# Altium project COMM_BOARD_V1.PrjPcb (part 1 of 2)
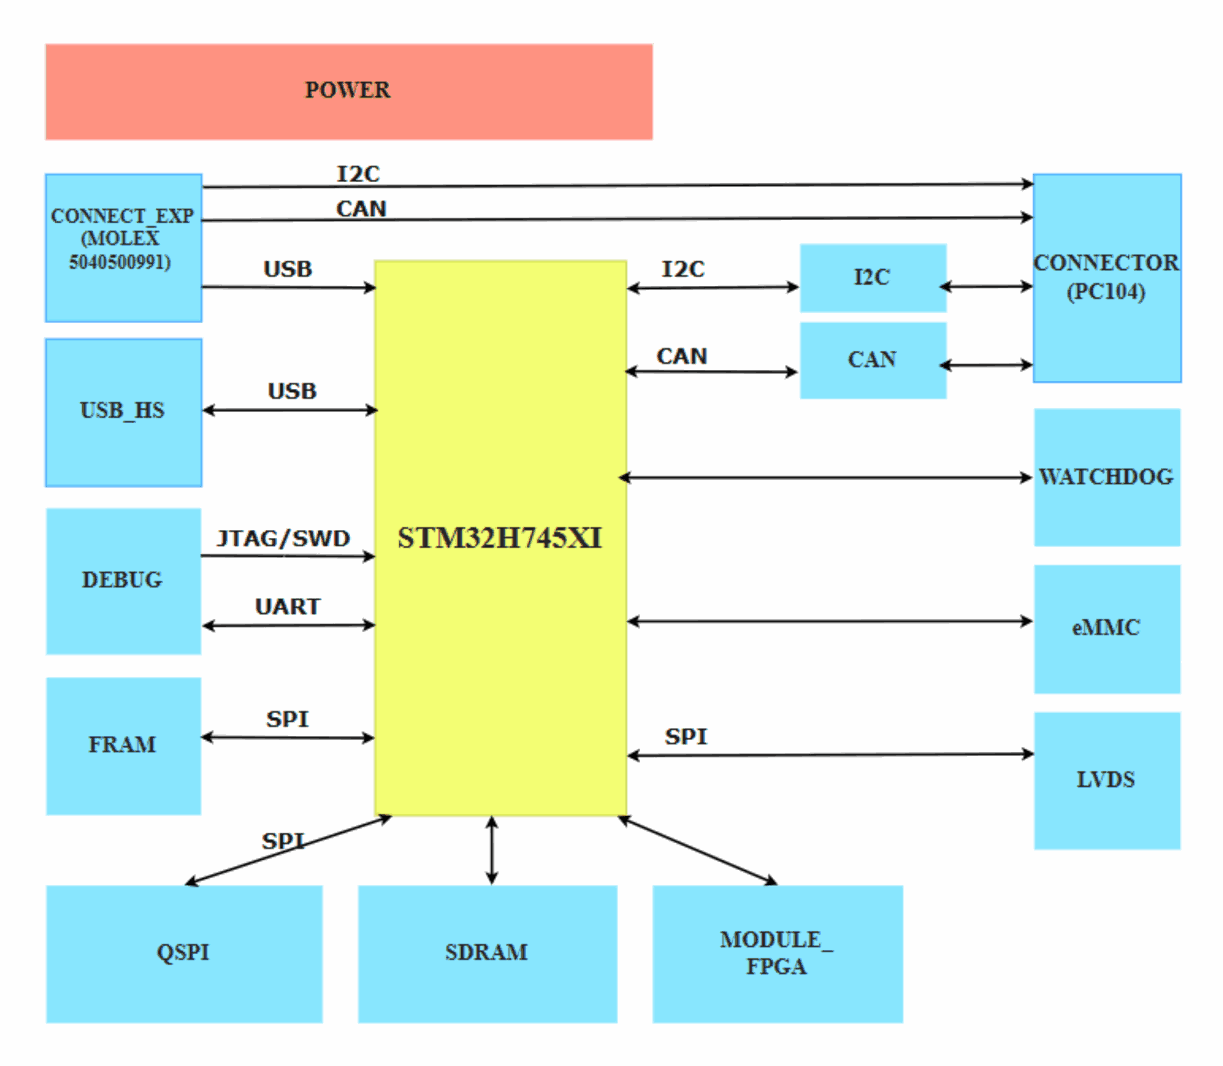
[diagram p0: BLOCK_DIAGRAM.SchDoc]
Board_Assembly_Revision: 04; Board_Document_Date: 27-Sep-2024; Board_Name: STM32H7xxx-Disco; Board_PCB_Revision: B; Board_Reference: MB1381
17 sheets, 294 parts. Net scope: flat (ports and power ports of the same name join across sheets).
Board file: PAY-IF_R100.PcbDoc
Sheets:
  BLOCK_DIAGRAM.SchDoc
  POWER_TREE.SchDoc
  CONNECTOR.SchDoc
  POWER.SchDoc
  USB_FS.SchDoc
  eMMC.SchDoc
  SDRAM.SchDoc
  MRAM.SchDoc
  LVDS.SchDoc
  CAN.SchDoc
  I2C.SchDoc
  FRAM.SchDoc
  TEMP_CTRL.SchDoc
  WATCHDOG.SchDoc
  DEBUG.SchDoc
  MCU_POWER.SchDoc
  MCU.SchDoc

## Sheet BLOCK_DIAGRAM.SchDoc
size 420 x 297 mm; DocumentNumber: 1; SheetNumber: 1; SheetTotal: 16

### Notes on the sheet
- Project:
- BEE-PC1
- Sub-system:
- NANORACK_EXP_CONTROLLER
- Design by:
- SANG HUYNH
- BAO BUI Q.
- Sheet title:
- Sheet
- A3
- of
- Checked by:
- Approved by:
- VU PHAM
- Revision:
- Document No:
- V1.2.2
- Size:
- Date:

## Sheet POWER_TREE.SchDoc
size 420 x 297 mm; DocumentNumber: 2; SheetNumber: 2; SheetTotal: 16

### Notes on the sheet
- Project:
- BEE-PC1
- Sub-system:
- NANORACK_EXP_CONTROLLER
- Design by:
- SANG HUYNH
- BAO BUI Q.
- Sheet title:
- Sheet
- A3
- of
- Checked by:
- Approved by:
- VU PHAM
- Revision:
- Document No:
- V1.2.2
- Size:
- Date:
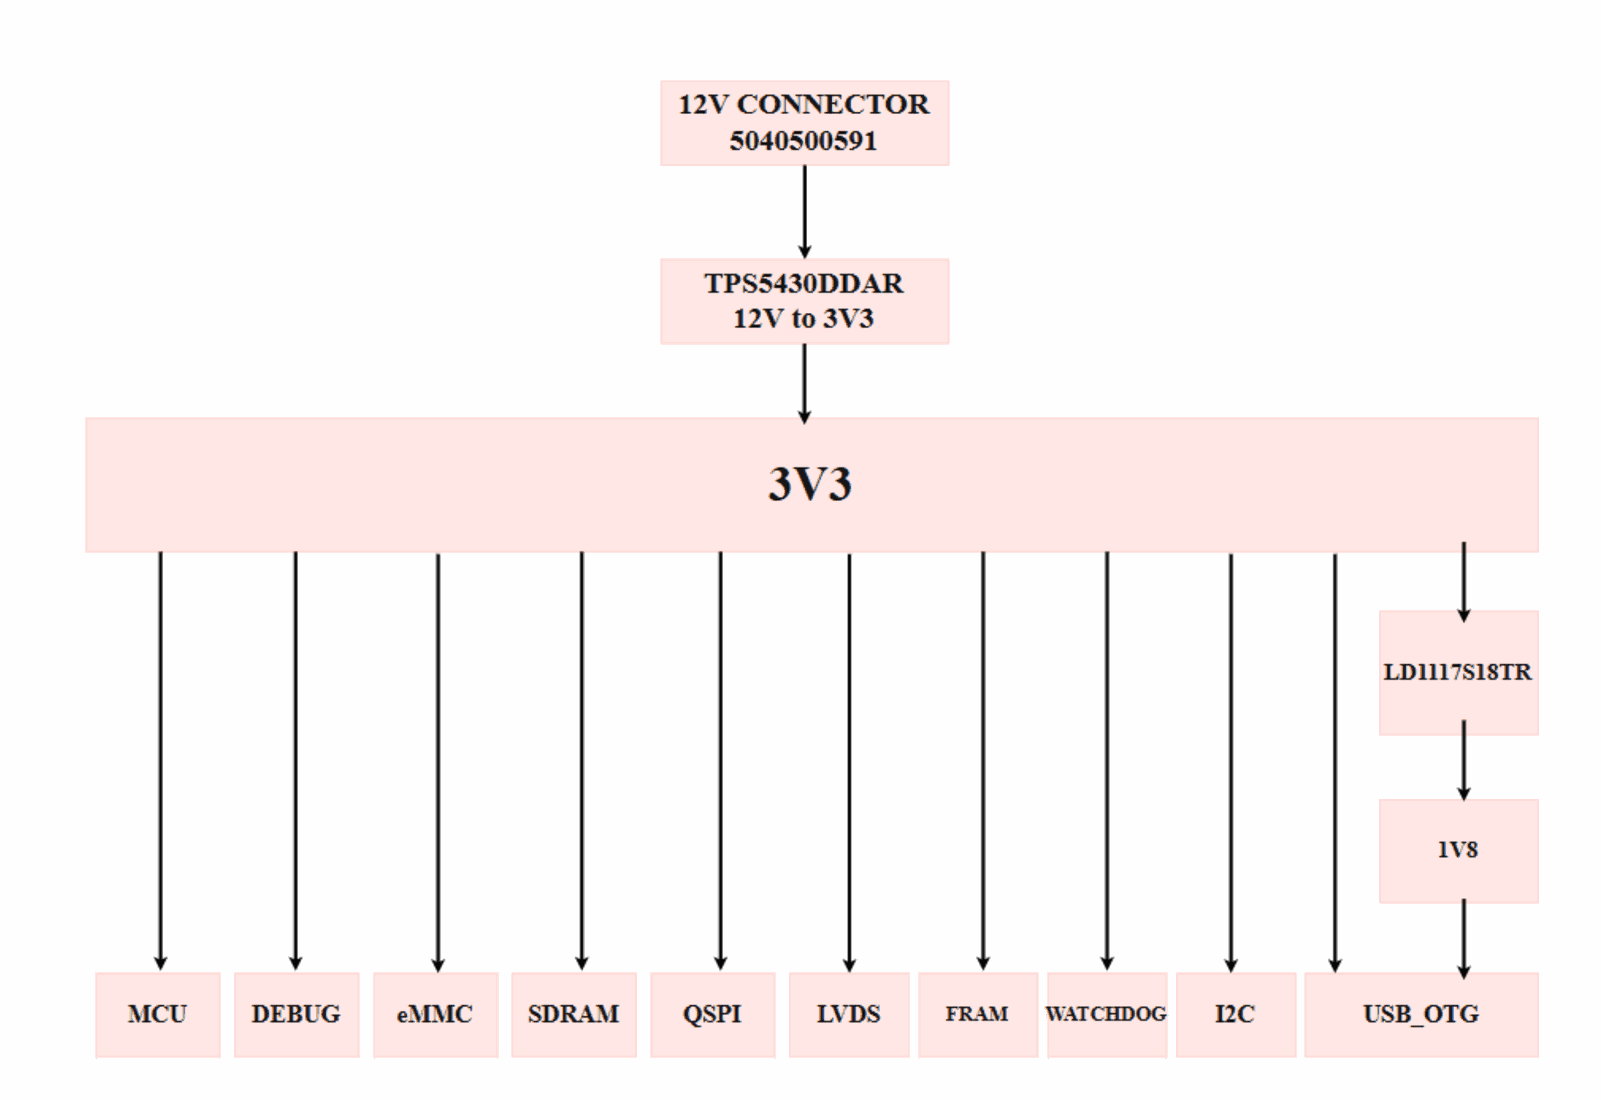
[diagram p1: POWER_TREE.SchDoc]

## Sheet CONNECTOR.SchDoc
size 420 x 297 mm; DocumentNumber: 3; SheetNumber: 3; SheetTotal: 17
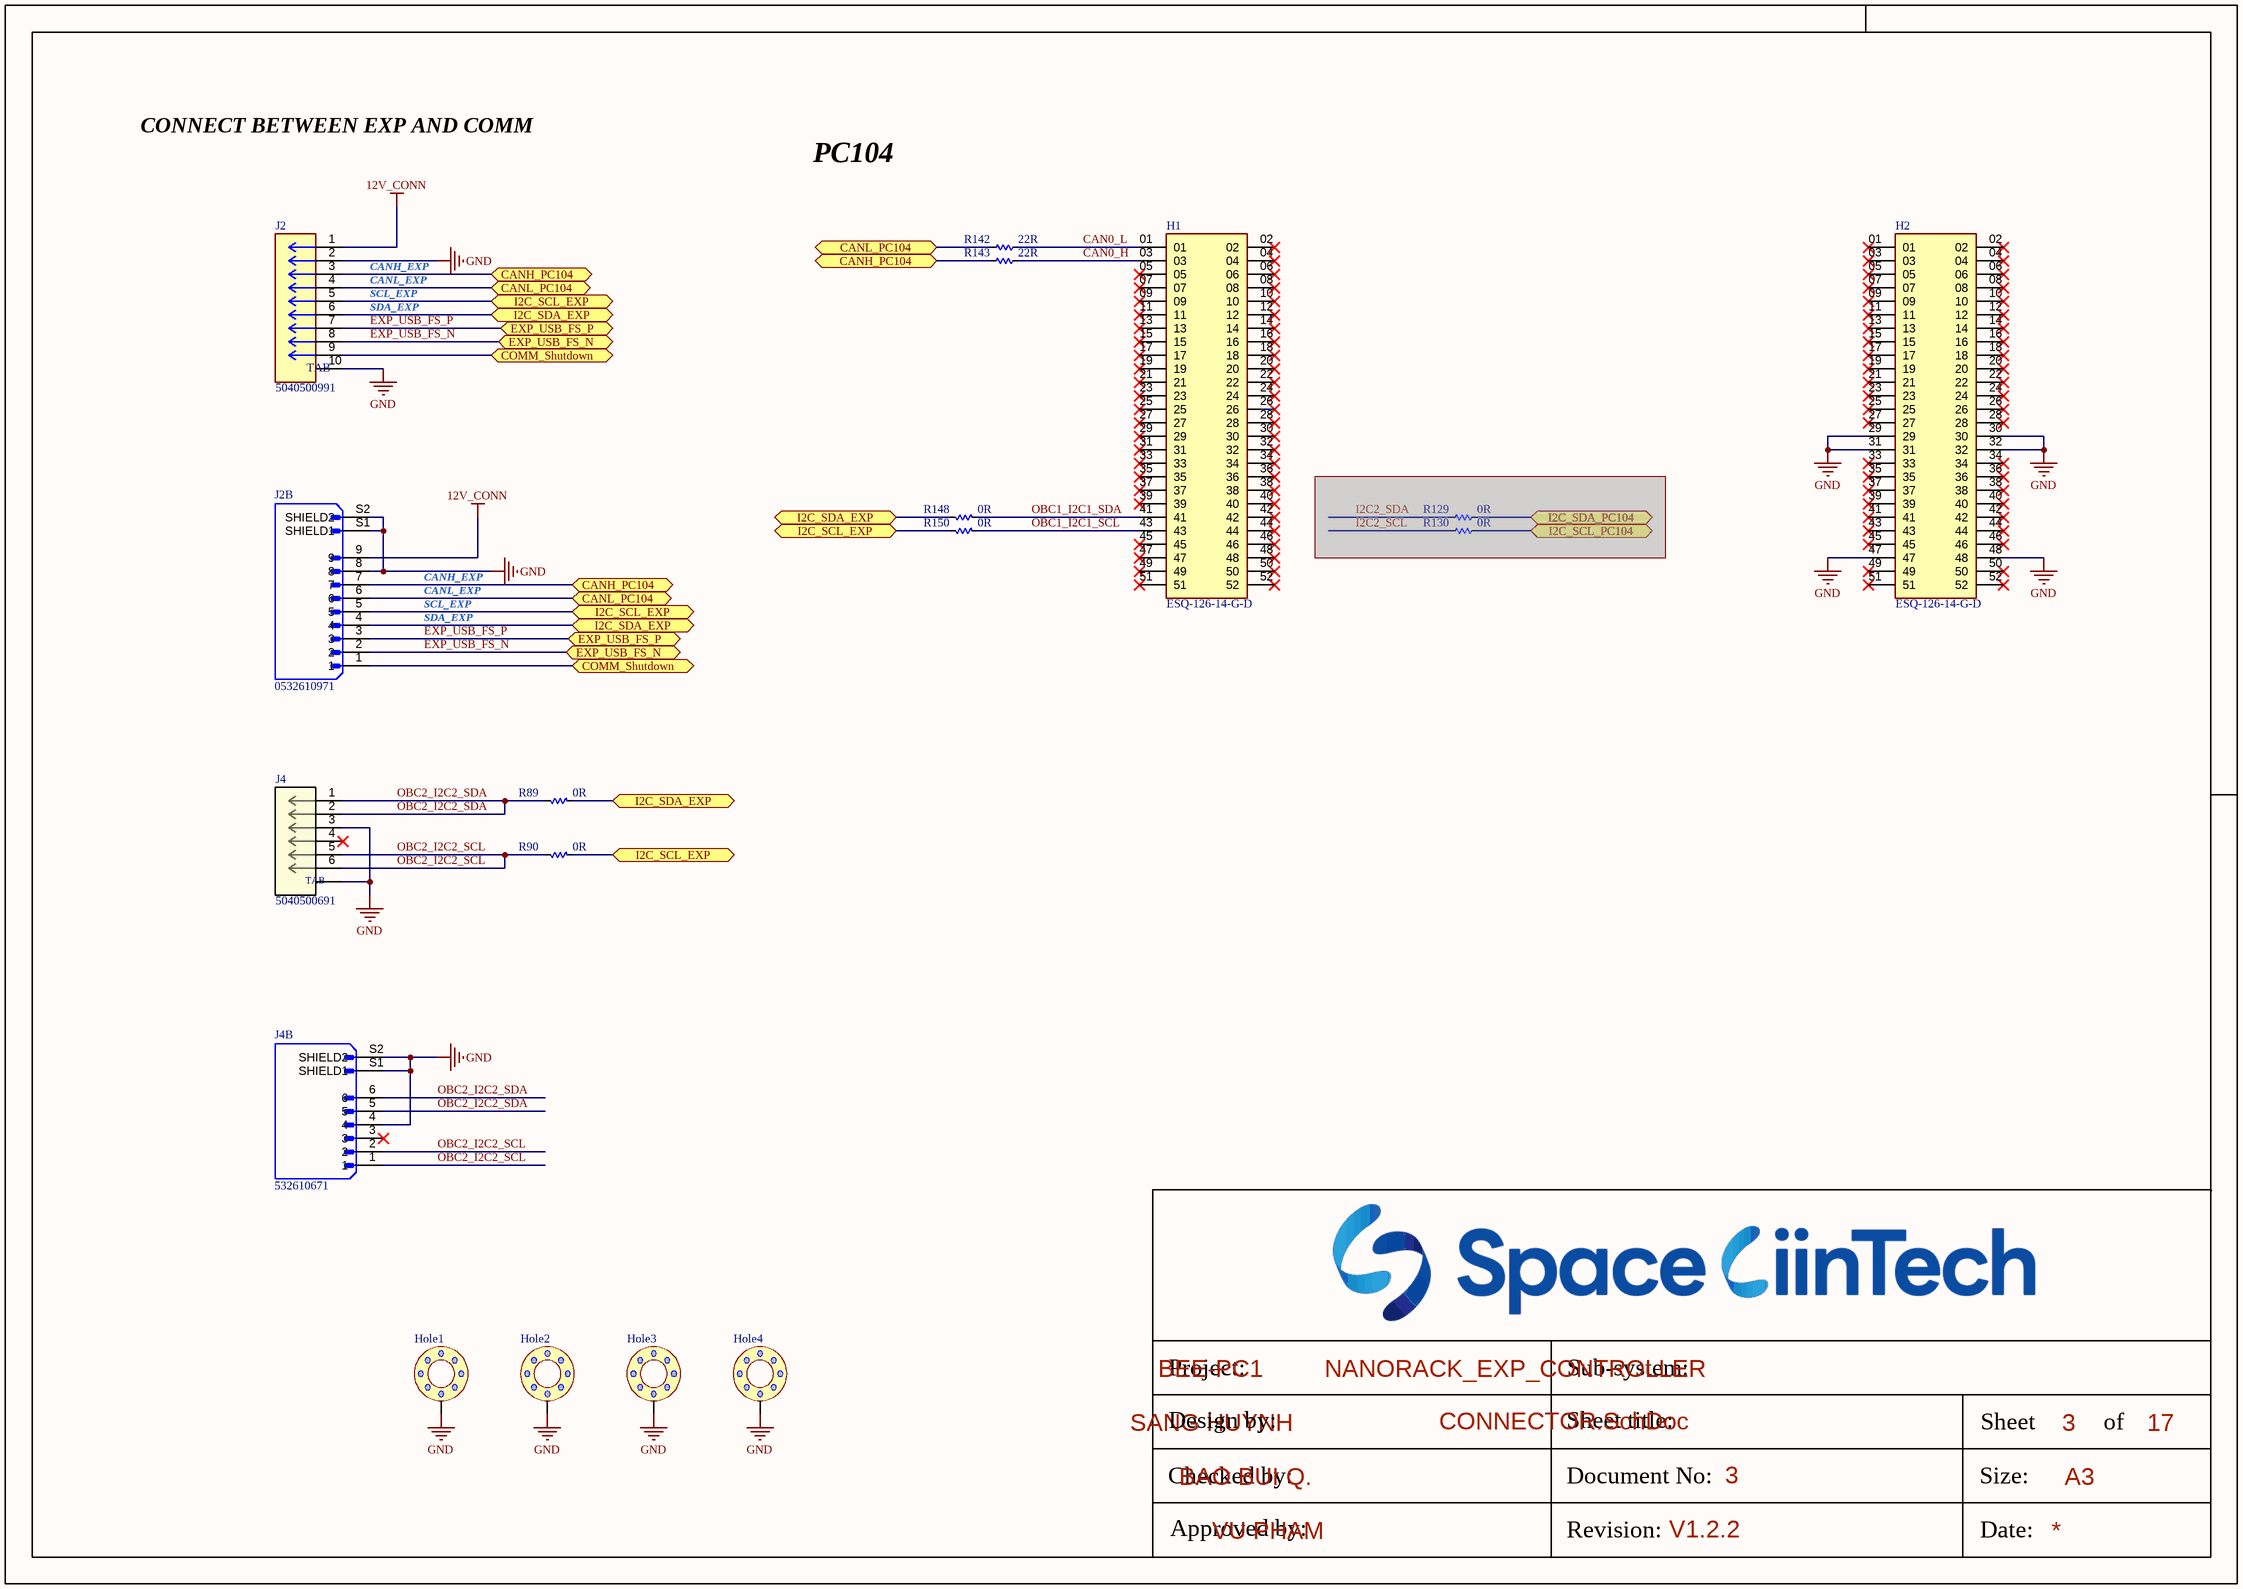
[diagram p2: CONNECTOR.SchDoc]

### Parts
H1  ESQ-126-14-G-D  [SAMTEC_ESQ-126-14-G-D]
H2  ESQ-126-14-G-D  [SAMTEC_ESQ-126-14-G-D]
Hole1  hole_space  [HOLE_SPACE]  (value not drawn)
Hole2  hole_space  [HOLE_SPACE]  (value not drawn)
Hole3  hole_space  [HOLE_SPACE]  (value not drawn)
Hole4  hole_space  [HOLE_SPACE]  (value not drawn)
J2  5040500991  [5040500991]
J2B  0532610971  [0532610971]
J4  5040500691  [5040500691]
J4B  532610671  [MOLEX_532610671]
R89  0R  [RES_C_1608X60]
R90  0R  [RES_C_1608X60]
R129  0R  [RES_C_1608X60]  (masked out: inside a compile mask, not in the netlist)
R130  0R  [RES_C_1608X60]  (masked out: inside a compile mask, not in the netlist)
R142  22R  [RES_C_1608X60]
R143  22R  [RES_C_1608X60]
R148  0R  [RES_C_1608X60]
R150  0R  [RES_C_1608X60]

### Ports
CANH_PC104 (bidir), CANL_PC104 (bidir), COMM_Shutdown (bidir), EXP_USB_FS_N (bidir), EXP_USB_FS_P (bidir), I2C_SCL_EXP (bidir), I2C_SCL_PC104 (bidir), I2C_SDA_EXP (bidir), I2C_SDA_PC104 (bidir)

### Nets
12V_CONN: J2.1 J2B.9
GND: H2.29 H2.30 H2.31 H2.32 H2.47 H2.48 Hole1.1 Hole2.1 Hole3.1 Hole4.1 J2.2 J2.10 J2B.8 J2B.S1(SHIELD1) J2B.S2(SHIELD2) J4.3 J4.7 J4B.4 J4B.S1(SHIELD1) J4B.S2(SHIELD2)
CAN0_H: H1.03 R143.2
CAN0_L: H1.01 R142.2
EXP_USB_FS_N: J2.8 J2B.2 ; port EXP_USB_FS_N
EXP_USB_FS_P: J2.7 J2B.3 ; port EXP_USB_FS_P
OBC1_I2C1_SCL: H1.43 R150.1
OBC1_I2C1_SDA: H1.41 R148.1
OBC2_I2C2_SCL: J4.5 J4.6 J4B.1 J4B.2 R90.2
OBC2_I2C2_SDA: J4.1 J4.2 J4B.5 J4B.6 R89.2
NetJ2_3: J2.3 J2B.7 R143.1 ; port CANH_PC104
NetJ2_4: J2.4 J2B.6 R142.1 ; port CANL_PC104
NetJ2_5: J2.5 J2B.5 R90.1 R150.2 ; port I2C_SCL_EXP
NetJ2_6: J2.6 J2B.4 R89.1 R148.2 ; port I2C_SDA_EXP
NetJ2_9: J2.9 J2B.1 ; port COMM_Shutdown

Not connected (* = marked no-connect by the designer): H1 02* 04* 05* 06* 07* 08* 09* 10* 11* 12* 13* 14* 15* 16* 17* 18* 19* 20* 21* 22* 23* 24* 25* 26* 27* 28* 29* 30* 31* 32* 33* 34* 35* 36* 37* 38* 39* 40* 42* 44* 45* 46* 47* 48* 49* 50* 51* 52*; H2 01* 02* 03* 04* 05* 06* 07* 08* 09* 10* 11* 12* 13* 14* 15* 16* 17* 18* 19* 20* 21* 22* 23* 24* 25* 26* 27* 28* 33* 34* 35* 36* 37* 38* 39* 40* 41* 42* 43* 44* 45* 46* 49* 50* 51* 52*; J4 4*; J4B 3*

### Notes on the sheet
- CONNECT BETWEEN EXP AND COMM
- PC104
- CANL_EXP
- CANH_EXP
- SCL_EXP
- SDA_EXP
- Project:
- BEE-PC1
- Sub-system:
- NANORACK_EXP_CONTROLLER
- Design by:
- SANG HUYNH
- BAO BUI Q.
- Sheet title:
- Sheet
- A3
- of
- Checked by:
- Approved by:
- VU PHAM
- Revision:
- Document No:
- V1.2.2
- Size:
- Date:
- (in symbol 5040500691) TAB
- (in symbol 5040500991) TAB

### Library data of the parts
H1 H2 = ESQ-126-14-G-D: MF: Samtec; MP: ESQ-126-14-G-D; Price: None; Package: None; Value: *; Availability: Unavailable
J2 = 5040500991: Connector Header Surface Mount, Right Angle 9 position 0.059" (1.50mm)
J2B = CONN_SMD_09: CONN HEADER SMD R/A 9POS 1.25MM
J4 = 5040500691: 1.50mm Pitch, Pico-Lock PCB Header, Single Row, Right-Angle, Surface Mount, Gold (Au) Plating, Positive Lock, 6 Circuits, Tape and Reel; Manufacturer_Name: Molex Connector Corporation; Copyright: Copyright (C) 2025 Ultra Librarian. All rights reserved.; Manufacturer_Part_Number: 5040500691; Datasheet: https://www.molex.com/en-us/products/part-detail-pdf/5040500691?display=pdf; RefDes: RefDes; Type: Type
J4B = CONN_SMD_06: Value: *; Availability: Unavailable; Package: None; MP: 532610671; Price: None
R89 R90 R129 R130 R142 R143 R148 R150 = _RES_B_2: RES

## Sheet POWER.SchDoc
size 420 x 297 mm; DocumentNumber: 4; SheetNumber: 4; SheetTotal: 17
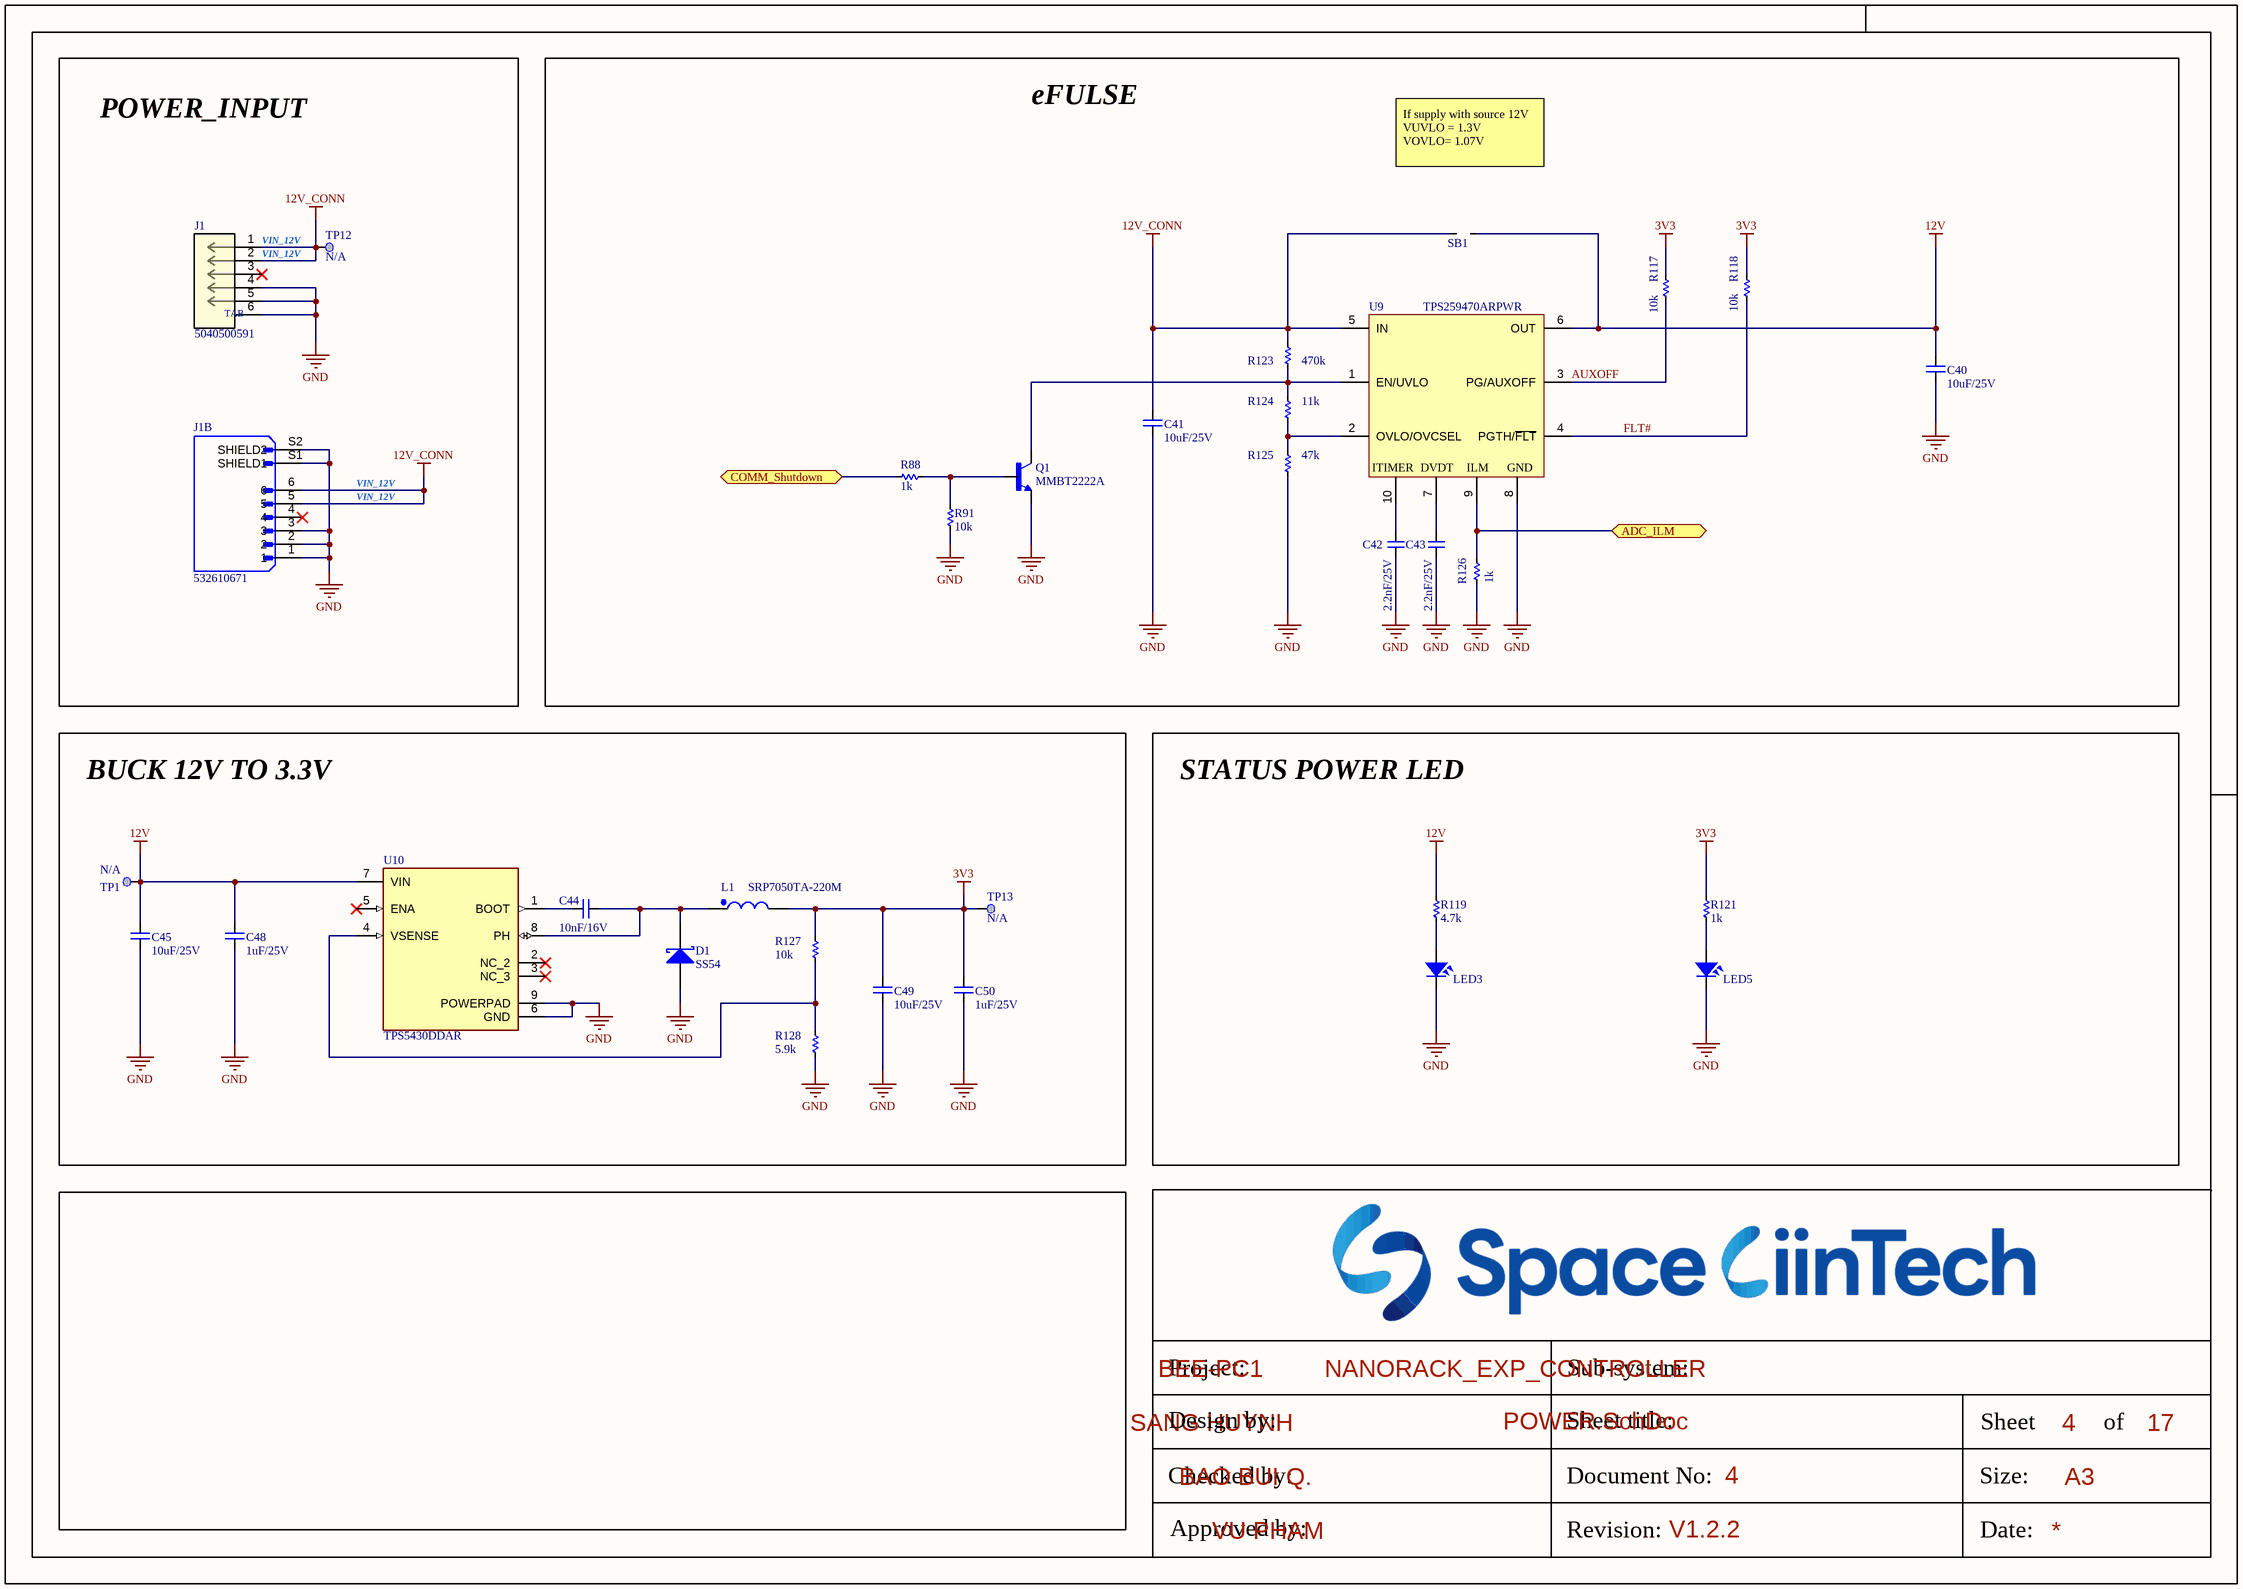
[diagram p3: POWER.SchDoc]

### Parts
C40  10uF/25V  [CAP_C_1608X80]
C41  10uF/25V  [CAP_C_1608X80]
C42  2.2nF/25V  [CAP_C_1608X80]
C43  2.2nF/25V  [CAP_C_1608X80]
C44  10nF/16V  [CAP_C_1608X80]
C45  10uF/25V  [CAP_C_1608X80]
C48  1uF/25V  [CAP_C_1608X80]
C49  10uF/25V  [CAP_C_1608X80]
C50  1uF/25V  [CAP_C_1608X80]
D1  SS54  [DO-214AC_SMA]
J1  5040500591  [5040500591]
J1B  532610671  [MOLEX_532610671]
L1  SRP7050TA-220M  [SRP7050TA-220M]
LED3  150060RS75000  [LED_0603]  (value not drawn)
LED5  150060YS75000  [LED_0603]  (value not drawn)
Q1  MMBT2222A  [SOT95P240X120-3N]
R88  1k  [RES_C_1608X60]
R91  10k  [RES_C_1608X60]
R117  10k  [RES_C_1608X60]
R118  10k  [RES_C_1608X60]
R119  4.7k  [RES_C_1608X60]
R121  1k  [RES_C_1608X60]
R123  470k  [RES_C_1608X60]
R124  11k  [RES_C_1608X60]
R125  47k  [RES_C_1608X60]
R126  1k  [RES_C_1608X60]
R127  10k  [RES_C_1608X60]
R128  5.9k  [RES_C_1608X60]
SB1  JUMPER  [JUMPER_1608]  (value not drawn)
TP1  Test Point  [TESTPOINT]  (value not drawn)  (no BOM)
TP12  Test Point  [TESTPOINT]  (value not drawn)  (no BOM)
TP13  Test Point  [TESTPOINT]  (value not drawn)  (no BOM)
U9  TPS259470ARPWR  [VQFN-HR-10]
U10  TPS5430DDAR  [CONV_TPS5430DDAR]

### Blocks framed on the sheet
POWER_INPUT: J1 J1B TP12
eFULSE: C40-C43 Q1 R88 R91 R117 R118 R123-R126 SB1 U9
BUCK 12V TO 3.3V: C44 C45 C48-C50 D1 L1 R127 R128 TP1 TP13 U10
STATUS POWER LED: LED3 LED5 R119 R121

### Ports
ADC_ILM (bidir), COMM_Shutdown (bidir)

### Nets
3V3: C49.2 C50.2 L1.2 R117.2 R118.2 R121.2 R127.1 TP13.1
12V: C40.2 C45.2 C48.2 R119.2 SB1.2 TP1.1 U9.6(OUT) U10.7(VIN)
12V_CONN: C41.2 J1.1 J1.2 J1B.5 J1B.6 R123.1 SB1.1 TP12.1 U9.5(IN)
GND: C40.1 C41.1 C42.1 C43.1 C45.1 C48.1 C49.1 C50.1 D1.1(A) J1.4 J1.5 J1.6 J1B.1 J1B.2 J1B.3 J1B.S1(SHIELD1) J1B.S2(SHIELD2) LED3.2 LED5.2 Q1.2(E) R91.1 R125.2 R126.2 R128.2 U9.8(GND) U10.6(GND) U10.9(POWERPAD)
AUXOFF: R117.1 U9.3(PG/AUXOFF)
FLT#: R118.1 U9.4(PGTH/~{FLT})
NetC42_2: C42.2 U9.10(ITIMER)
NetC43_2: C43.2 U9.7(DVDT)
NetC44_1: C44.1 D1.2(K) L1.1 U10.8(PH)
NetC44_2: C44.2 U10.1(BOOT)
NetJ2_9: R88.1 ; port COMM_Shutdown
NetLED3_1: LED3.1 R119.1
NetLED5_1: LED5.1 R121.1
NetQ1_1: Q1.1(B) R88.2 R91.2
NetQ1_3: Q1.3(C) R123.2 R124.1 U9.1(EN/UVLO)
NetR85_1: R126.1 U9.9(ILM) ; port ADC_ILM
NetR124_2: R124.2 R125.1 U9.2(OVLO/OVCSEL)
NetR127_2: R127.2 R128.1 U10.4(VSENSE)

Not connected (* = marked no-connect by the designer): J1 3*; J1B 4*; U10 2(NC_2)* 3(NC_3)* 5(ENA)*

### Notes on the sheet
- If supply with source 12V
  VUVLO = 1.3V
  VOVLO= 1.07V
- VIN_12V
- Project:
- BEE-PC1
- Sub-system:
- NANORACK_EXP_CONTROLLER
- Design by:
- SANG HUYNH
- BAO BUI Q.
- Sheet title:
- Sheet
- A3
- of
- Checked by:
- Approved by:
- VU PHAM
- Revision:
- Document No:
- V1.2.2
- Size:
- Date:
- (in symbol 5040500591) TAB

### Library data of the parts
C40 C41 C44 C45 C48-C50 = CAP_SMD: CAP_Chip; Value: 33pF
C42 C43 = _CAP_C_2: CAP CHIP
D1 = SS54: DIODE SCHOTTKY 40V 5A SMA; MPN: SS34; Solder: SMT; Value: SS34; MFR: *
J1 = 5040500591: 1.50mm Pitch, Pico-Lock PCB Header, Single Row, Right-Angle, Surface Mount, Gold (Au) Plating, Positive Lock, 5 Circuits, Tape and Reel; Manufacturer_Name: Molex Connector Corporation; Copyright: Copyright (C) 2025 Ultra Librarian. All rights reserved.; Manufacturer_Part_Number: 5040500591; RefDes: RefDes; Type: Type
J1B = CONN_SMD_06: Value: *; Availability: Unavailable; Package: None; MP: 532610671; Price: None
L1 = _IND: FIXED IND 22UH 2.5A 170 MOHM SMD
LED3 LED5 = LED SMD: Value: LED 3 - 5 ly 2 Colour
Q1 = MMBT2222A: BJT, SOT-23, 40V, 600mA, NPN, 0.25W, 150Â°C; MF: Diotec Semiconductor; SnapEDA_Link: https://www.snapeda.com/parts/MMBT2222A/Diotec/view-part/?ref=snap; Package: SOT-23 Diotec; Value: *; MP: MMBT2222A; Check_prices: https://www.snapeda.com/parts/MMBT2222A/Diotec/view-part/?ref=eda
R88 R91 R117-R119 R121 R123-R128 = _RES_B_2: RES
TP1 TP12 TP13 = MCD-00630: Test Point 0.3mm; Part_Type: Misc; Part_Preference: Recommended; Initial_Board_Reference: MB1264; ID: 3115; ShowFields: YES; Component_Country_Of_Origin: Unknown; Internal_Part_Number: MCD-00630; Status: Released; ECCN_US: n/a; ECCN_EU: n/a; Provided_By: n/a; Manufacturer: N/A; Manufacturer_Part_Number: N/A; Order_Code_Digikey: N/A; Order_Code_Farnell: N/A; Order_Code_RS: N/A; Value: N/A; ComponentLink1URL: http://tunmcdsvn.tun.st.com/Component_Documentation_Library/Trunk; Manufacturer_HQ_COO: Unknown
U10 = TPS5430DDAR: 5.5V to 36V Input, 3A, 500kHz Step-Down Converter; MF: Texas Instruments; Package: HSOIC-8 Texas Instruments; Check_prices: https://www.snapeda.com/parts/TPS5430DDAR/Texas+Instruments/view-part/?ref=eda; Value: *; Purchase-URL: https://pricing.snapeda.com/search/part/TPS5430DDAR/?ref=eda; Availability: In Stock; SnapEDA_Link: https://www.snapeda.com/parts/TPS5430DDAR/Texas+Instruments/view-part/?ref=snap; MP: TPS5430DDAR; Price: None

## Sheet USB_FS.SchDoc
size 420 x 297 mm; DocumentNumber: 5; SheetNumber: 5; SheetTotal: 17
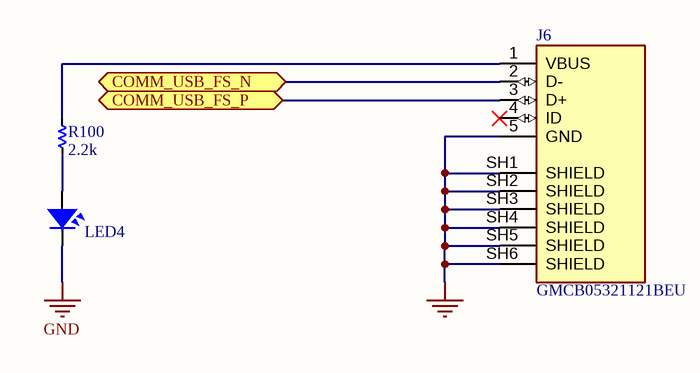
[diagram p4: USB_FS.SchDoc]

### Parts
J6  GMCB05321121BEU  [AMPHENOL_GMCB05321121BEU]
LED4  150060RS75000  [LED_0603]  (value not drawn)
R100  2.2k  [RES_C_1608X60]

### Ports
COMM_USB_FS_N (bidir), COMM_USB_FS_P (bidir)

### Nets
GND: J6.5(GND) J6.SH1(SHIELD) J6.SH2(SHIELD) J6.SH3(SHIELD) J6.SH4(SHIELD) J6.SH5(SHIELD) J6.SH6(SHIELD) LED4.2
COMM_USB_FS_N: J6.2(D-) ; port COMM_USB_FS_N
COMM_USB_FS_P: J6.3(D+) ; port COMM_USB_FS_P
NetJ6_1: J6.1(VBUS) R100.2
NetLED4_1: LED4.1 R100.1

Not connected (* = marked no-connect by the designer): J6 4(ID)*

### Notes on the sheet
- Project:
- BEE-PC1
- Sub-system:
- NANORACK_EXP_CONTROLLER
- Design by:
- SANG HUYNH
- BAO BUI Q.
- Sheet title:
- Sheet
- A3
- of
- Checked by:
- Approved by:
- VU PHAM
- Revision:
- Document No:
- V1.2.2
- Size:
- Date:

### Library data of the parts
J6 = GMCB05321121BEU: Micro USB 2.0 Type B Receptacle Right Angle SMT, Tape and Reel Packaging; MF: Amphenol Commercial Products; SnapEDA_Link: https://www.snapeda.com/parts/GMCB05321121BEU/Amphenol/view-part/?ref=snap; Package: None; Value: *; MP: GMCB05321121BEU; Check_prices: https://www.snapeda.com/parts/GMCB05321121BEU/Amphenol/view-part/?ref=eda
LED4 = LED SMD: Value: LED 3 - 5 ly 2 Colour
R100 = _RES_B_2: RES

## Sheet eMMC.SchDoc: eMMC
size 420 x 297 mm; CompanyName: STMicroelectronics; Organization: Microcontrollers Division; DocumentNumber: 6; SheetNumber: 6; SheetTotal: 17
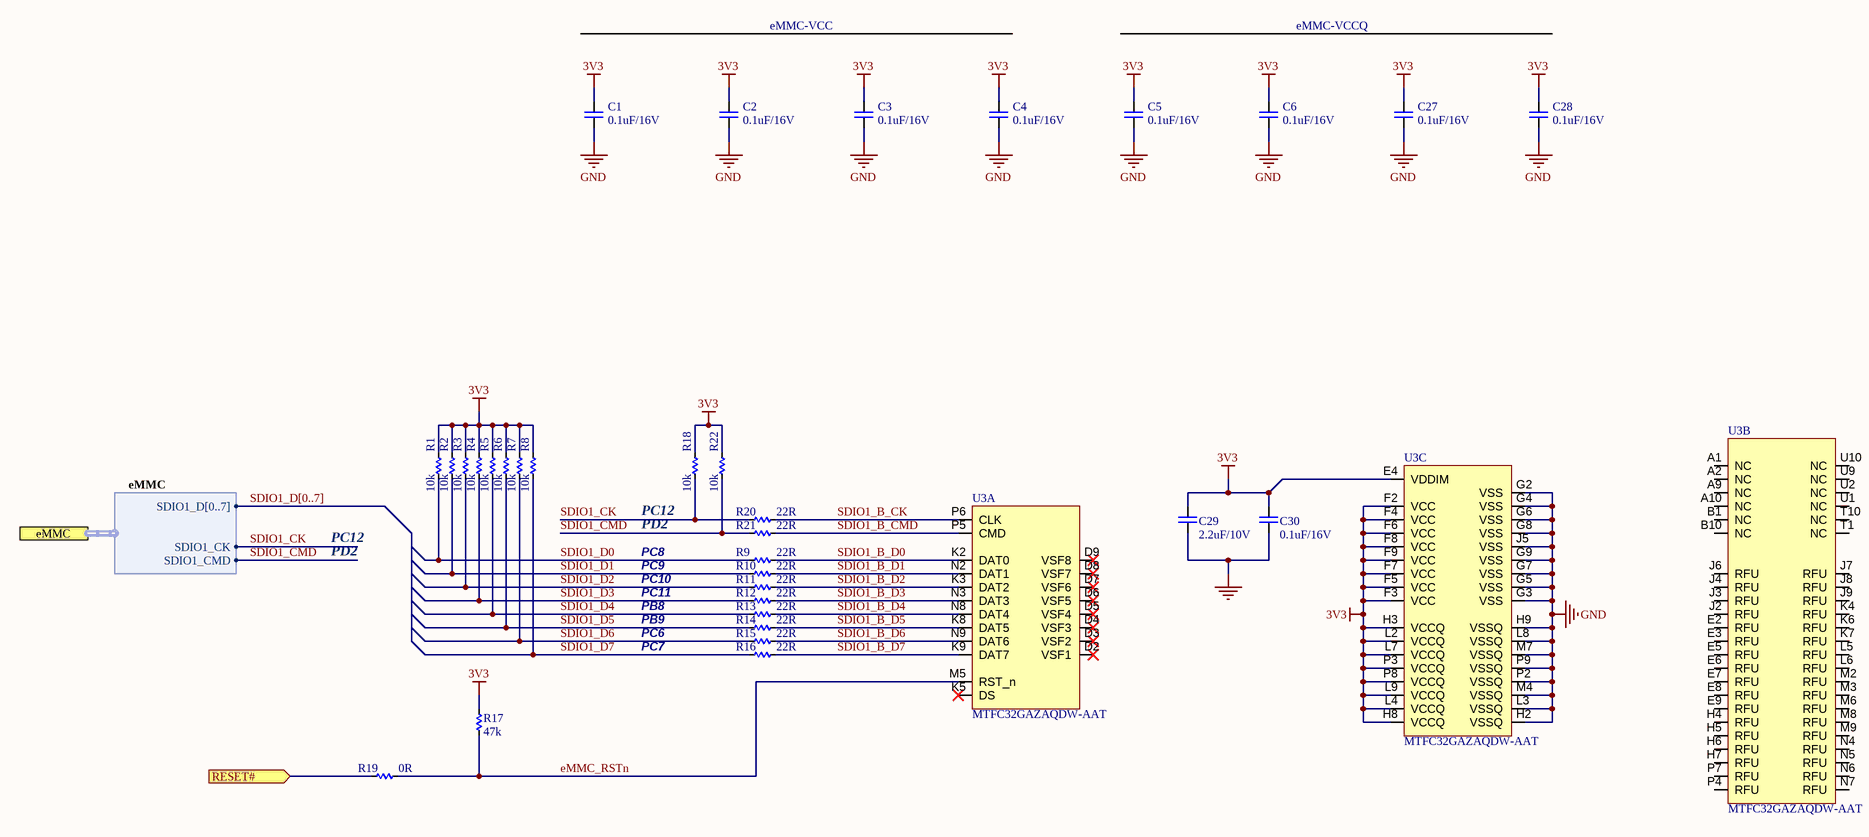
[diagram p5: eMMC.SchDoc]

### Parts
C1  0.1uF/16V  [CAP_C_1608X80]
C2  0.1uF/16V  [CAP_C_1608X80]
C3  0.1uF/16V  [CAP_C_1608X80]
C4  0.1uF/16V  [CAP_C_1608X80]
C5  0.1uF/16V  [CAP_C_1608X80]
C6  0.1uF/16V  [CAP_C_1608X80]
C27  0.1uF/16V  [CAP_C_1608X80]
C28  0.1uF/16V  [CAP_C_1608X80]
C29  2.2uF/10V  [CAP_C_1608X80]
C30  0.1uF/16V  [CAP_C_1608X80]
R1  10k  [RES_C_1608X60]
R2  10k  [RES_C_1608X60]
R3  10k  [RES_C_1608X60]
R4  10k  [RES_C_1608X60]
R5  10k  [RES_C_1608X60]
R6  10k  [RES_C_1608X60]
R7  10k  [RES_C_1608X60]
R8  10k  [RES_C_1608X60]
R9  22R  [RES_C_1608X60]
R10  22R  [RES_C_1608X60]
R11  22R  [RES_C_1608X60]
R12  22R  [RES_C_1608X60]
R13  22R  [RES_C_1608X60]
R14  22R  [RES_C_1608X60]
R15  22R  [RES_C_1608X60]
R16  22R  [RES_C_1608X60]
R17  47k  [RES_C_1608X60]
R18  10k  [RES_C_1608X60]
R19  0R  [RES_C_1608X60]
R20  22R  [RES_C_1608X60]
R21  22R  [RES_C_1608X60]
R22  10k  [RES_C_1608X60]
U3  MTFC32GAZAQDW-AAT  [BGA_100_C_100P_10X17_1400X1800X150]  (parts A,B,C of 3)

### Ports
eMMC (harness eMMC), RESET# (in)

### Harnesses
eMMC: SDIO1_D[0..7], SDIO1_CMD, SDIO1_CK

### Nets
3V3: C1.2 C2.2 C3.2 C4.2 C5.2 C6.2 C27.2 C28.2 C29.2 C30.2 R1.2 R2.2 R3.2 R4.2 R5.2 R6.2 R7.2 R8.2 R17.2 R18.2 R22.2 U3.E4(VDDIM) U3.F2(VCC) U3.F3(VCC) U3.F4(VCC) U3.F5(VCC) U3.F6(VCC) U3.F7(VCC) U3.F8(VCC) U3.F9(VCC) U3.H3(VCCQ) U3.H8(VCCQ) U3.L2(VCCQ) U3.L4(VCCQ) U3.L7(VCCQ) U3.L9(VCCQ) U3.P3(VCCQ) U3.P8(VCCQ)
GND: C1.1 C2.1 C3.1 C4.1 C5.1 C6.1 C27.1 C28.1 C29.1 C30.1 U3.G2(VSS) U3.G3(VSS) U3.G4(VSS) U3.G5(VSS) U3.G6(VSS) U3.G7(VSS) U3.G8(VSS) U3.G9(VSS) U3.H2(VSSQ) U3.H9(VSSQ) U3.J5(VSS) U3.L3(VSSQ) U3.L8(VSSQ) U3.M4(VSSQ) U3.M7(VSSQ) U3.P2(VSSQ) U3.P9(VSSQ)
eMMC_RSTn: R17.1 R19.1 U3.M5(RST_n)
RESET#: R19.2 ; port RESET#
SDIO1_B_CK: R20.2 U3.P6(CLK)
SDIO1_B_CMD: R21.2 U3.P5(CMD)
SDIO1_B_D0: R9.2 U3.K2(DAT0)
SDIO1_B_D1: R10.2 U3.N2(DAT1)
SDIO1_B_D2: R11.2 U3.K3(DAT2)
SDIO1_B_D3: R12.2 U3.N3(DAT3)
SDIO1_B_D4: R13.2 U3.N8(DAT4)
SDIO1_B_D5: R14.2 U3.K8(DAT5)
SDIO1_B_D6: R15.2 U3.N9(DAT6)
SDIO1_B_D7: R16.2 U3.K9(DAT7)
SDIO1_CK: R18.1 R20.1 ; port eMMC.SDIO1_CK
SDIO1_CMD: R21.1 R22.1 ; port eMMC.SDIO1_CMD
SDIO1_D0: R1.1 R9.1
SDIO1_D1: R2.1 R10.1
SDIO1_D2: R3.1 R11.1
SDIO1_D3: R4.1 R12.1
SDIO1_D4: R5.1 R13.1
SDIO1_D5: R6.1 R14.1
SDIO1_D6: R7.1 R15.1
SDIO1_D7: R8.1 R16.1

Not connected (* = marked no-connect by the designer): U3 A1(NC) A2(NC) A9(NC) A10(NC) B1(NC) B10(NC) D2(VSF1)* D3(VSF2)* D4(VSF3)* D5(VSF4)* D6(VSF5)* D7(VSF6)* D8(VSF7)* D9(VSF8)* E2(RFU) E3(RFU) E5(RFU) E6(RFU) E7(RFU) E8(RFU) E9(RFU) H4(RFU) H5(RFU) H6(RFU) H7(RFU) J2(RFU) J3(RFU) J4(RFU) J6(RFU) J7(RFU) J8(RFU) J9(RFU) K4(RFU) K5(DS)* K6(RFU) K7(RFU) L5(RFU) L6(RFU) M2(RFU) M3(RFU) M6(RFU) M8(RFU) M9(RFU) N4(RFU) N5(RFU) N6(RFU) N7(RFU) P4(RFU) P7(RFU) T1(NC) T10(NC) U1(NC) U2(NC) U9(NC) U10(NC)

### Buses and harness runs
bus SDIO1_D[0..7]

### Notes on the sheet
- eMMC-VCC
- eMMC-VCCQ
- PC12
- PD2
- PC8
- PC9
- PC10
- PC11
- PB8
- PC6
- PC7
- PB9
- Project:
- BEE-PC1
- Sub-system:
- NANORACK_EXP_CONTROLLER
- Design by:
- SANG HUYNH
- BAO BUI Q.
- Sheet title:
- Sheet
- A3
- of
- Checked by:
- Approved by:
- VU PHAM
- Revision:
- Document No:
- V1.2.2
- Size:
- Date:

### Library data of the parts
C1-C6 C27-C30 = CAP_SMD: CAP_Chip; Value: 33pF
R1-R22 = _RES_B_2: RES

## Sheet SDRAM.SchDoc: SDRAM
size 420 x 297 mm; CompanyName: STMicroelectronics; Organization: Microcontrollers Division; DocumentNumber: 7; SheetNumber: 7; SheetTotal: 17
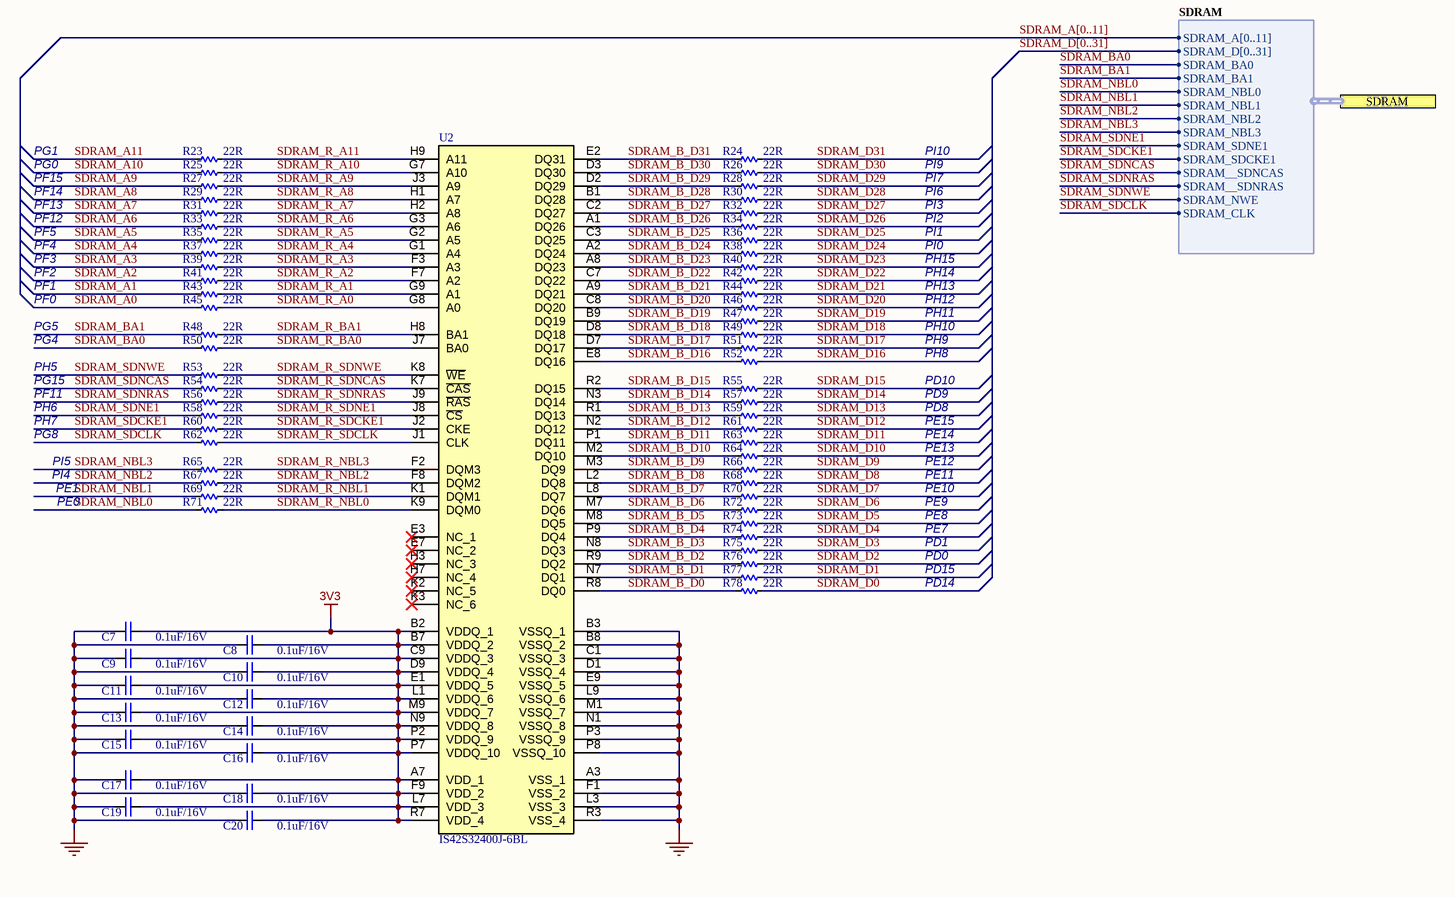
[diagram p6: SDRAM.SchDoc]

### Parts
C7  0.1uF/16V  [CAP_C_1608X80]
C8  0.1uF/16V  [CAP_C_1608X80]
C9  0.1uF/16V  [CAP_C_1608X80]
C10  0.1uF/16V  [CAP_C_1608X80]
C11  0.1uF/16V  [CAP_C_1608X80]
C12  0.1uF/16V  [CAP_C_1608X80]
C13  0.1uF/16V  [CAP_C_1608X80]
C14  0.1uF/16V  [CAP_C_1608X80]
C15  0.1uF/16V  [CAP_C_1608X80]
C16  0.1uF/16V  [CAP_C_1608X80]
C17  0.1uF/16V  [CAP_C_1608X80]
C18  0.1uF/16V  [CAP_C_1608X80]
C19  0.1uF/16V  [CAP_C_1608X80]
C20  0.1uF/16V  [CAP_C_1608X80]
R23  22R  [RES_C_1608X60]
R24  22R  [RES_C_1608X60]
R25  22R  [RES_C_1608X60]
R26  22R  [RES_C_1608X60]
R27  22R  [RES_C_1608X60]
R28  22R  [RES_C_1608X60]
R29  22R  [RES_C_1608X60]
R30  22R  [RES_C_1608X60]
R31  22R  [RES_C_1608X60]
R32  22R  [RES_C_1608X60]
R33  22R  [RES_C_1608X60]
R34  22R  [RES_C_1608X60]
R35  22R  [RES_C_1608X60]
R36  22R  [RES_C_1608X60]
R37  22R  [RES_C_1608X60]
R38  22R  [RES_C_1608X60]
R39  22R  [RES_C_1608X60]
R40  22R  [RES_C_1608X60]
R41  22R  [RES_C_1608X60]
R42  22R  [RES_C_1608X60]
R43  22R  [RES_C_1608X60]
R44  22R  [RES_C_1608X60]
R45  22R  [RES_C_1608X60]
R46  22R  [RES_C_1608X60]
R47  22R  [RES_C_1608X60]
R48  22R  [RES_C_1608X60]
R49  22R  [RES_C_1608X60]
R50  22R  [RES_C_1608X60]
R51  22R  [RES_C_1608X60]
R52  22R  [RES_C_1608X60]
R53  22R  [RES_C_1608X60]
R54  22R  [RES_C_1608X60]
R55  22R  [RES_C_1608X60]
R56  22R  [RES_C_1608X60]
R57  22R  [RES_C_1608X60]
R58  22R  [RES_C_1608X60]
R59  22R  [RES_C_1608X60]
R60  22R  [RES_C_1608X60]
R61  22R  [RES_C_1608X60]
R62  22R  [RES_C_1608X60]
R63  22R  [RES_C_1608X60]
R64  22R  [RES_C_1608X60]
R65  22R  [RES_C_1608X60]
R66  22R  [RES_C_1608X60]
R67  22R  [RES_C_1608X60]
R68  22R  [RES_C_1608X60]
R69  22R  [RES_C_1608X60]
R70  22R  [RES_C_1608X60]
R71  22R  [RES_C_1608X60]
R72  22R  [RES_C_1608X60]
R73  22R  [RES_C_1608X60]
R74  22R  [RES_C_1608X60]
R75  22R  [RES_C_1608X60]
R76  22R  [RES_C_1608X60]
R77  22R  [RES_C_1608X60]
R78  22R  [RES_C_1608X60]
U2  IS42S32400J-6BL  [BGA90C80P9X15_800X1300X120]

### Ports
SDRAM (harness SDRAM)

### Harnesses
SDRAM: SDRAM_A[0..11], SDRAM__SDNCAS, SDRAM_NBL0, SDRAM_SDNE1, SDRAM_SDCKE1, SDRAM_D[0..31], SDRAM_NBL1, SDRAM_BA0, SDRAM_BA1, SDRAM_NWE, SDRAM_CLK, SDRAM__SDNRAS, SDRAM_NBL3, SDRAM_NBL2

### Nets
3V3: C7.2 C8.2 C9.2 C10.2 C11.2 C12.2 C13.2 C14.2 C15.2 C16.2 C17.2 C18.2 C19.2 C20.2 U2.A7(VDD_1) U2.B2(VDDQ_1) U2.B7(VDDQ_2) U2.C9(VDDQ_3) U2.D9(VDDQ_4) U2.E1(VDDQ_5) U2.F9(VDD_2) U2.L1(VDDQ_6) U2.L7(VDD_3) U2.M9(VDDQ_7) U2.N9(VDDQ_8) U2.P2(VDDQ_9) U2.P7(VDDQ_10) U2.R7(VDD_4)
GND: C7.1 C8.1 C9.1 C10.1 C11.1 C12.1 C13.1 C14.1 C15.1 C16.1 C17.1 C18.1 C19.1 C20.1 U2.A3(VSS_1) U2.B3(VSSQ_1) U2.B8(VSSQ_2) U2.C1(VSSQ_3) U2.D1(VSSQ_4) U2.E9(VSSQ_5) U2.F1(VSS_2) U2.L3(VSS_3) U2.L9(VSSQ_6) U2.M1(VSSQ_7) U2.N1(VSSQ_8) U2.P3(VSSQ_9) U2.P8(VSSQ_10) U2.R3(VSS_4)
SDRAM_A0: R45.1
SDRAM_A1: R43.1
SDRAM_A2: R41.1
SDRAM_A3: R39.1
SDRAM_A4: R37.1
SDRAM_A5: R35.1
SDRAM_A6: R33.1
SDRAM_A7: R31.1
SDRAM_A8: R29.1
SDRAM_A9: R27.1
SDRAM_A10: R25.1
SDRAM_A11: R23.1
SDRAM_B_D0: R78.1 U2.R8(DQ0)
SDRAM_B_D1: R77.1 U2.N7(DQ1)
SDRAM_B_D2: R76.1 U2.R9(DQ2)
SDRAM_B_D3: R75.1 U2.N8(DQ3)
SDRAM_B_D4: R74.1 U2.P9(DQ4)
SDRAM_B_D5: R73.1 U2.M8(DQ5)
SDRAM_B_D6: R72.1 U2.M7(DQ6)
SDRAM_B_D7: R70.1 U2.L8(DQ7)
SDRAM_B_D8: R68.1 U2.L2(DQ8)
SDRAM_B_D9: R66.1 U2.M3(DQ9)
SDRAM_B_D10: R64.1 U2.M2(DQ10)
SDRAM_B_D11: R63.1 U2.P1(DQ11)
SDRAM_B_D12: R61.1 U2.N2(DQ12)
SDRAM_B_D13: R59.1 U2.R1(DQ13)
SDRAM_B_D14: R57.1 U2.N3(DQ14)
SDRAM_B_D15: R55.1 U2.R2(DQ15)
SDRAM_B_D16: R52.1 U2.E8(DQ16)
SDRAM_B_D17: R51.1 U2.D7(DQ17)
SDRAM_B_D18: R49.1 U2.D8(DQ18)
SDRAM_B_D19: R47.1 U2.B9(DQ19)
SDRAM_B_D20: R46.1 U2.C8(DQ20)
SDRAM_B_D21: R44.1 U2.A9(DQ21)
SDRAM_B_D22: R42.1 U2.C7(DQ22)
SDRAM_B_D23: R40.1 U2.A8(DQ23)
SDRAM_B_D24: R38.1 U2.A2(DQ24)
SDRAM_B_D25: R36.1 U2.C3(DQ25)
SDRAM_B_D26: R34.1 U2.A1(DQ26)
SDRAM_B_D27: R32.1 U2.C2(DQ27)
SDRAM_B_D28: R30.1 U2.B1(DQ28)
SDRAM_B_D29: R28.1 U2.D2(DQ29)
SDRAM_B_D30: R26.1 U2.D3(DQ30)
SDRAM_B_D31: R24.1 U2.E2(DQ31)
SDRAM_BA0: R50.1 ; port SDRAM.SDRAM_BA0
SDRAM_BA1: R48.1 ; port SDRAM.SDRAM_BA1
SDRAM_D0: R78.2
SDRAM_D1: R77.2
SDRAM_D2: R76.2
SDRAM_D3: R75.2
SDRAM_D4: R74.2
SDRAM_D5: R73.2
SDRAM_D6: R72.2
SDRAM_D7: R70.2
SDRAM_D8: R68.2
SDRAM_D9: R66.2
SDRAM_D10: R64.2
SDRAM_D11: R63.2
SDRAM_D12: R61.2
SDRAM_D13: R59.2
SDRAM_D14: R57.2
SDRAM_D15: R55.2
SDRAM_D16: R52.2
SDRAM_D17: R51.2
SDRAM_D18: R49.2
SDRAM_D19: R47.2
SDRAM_D20: R46.2
SDRAM_D21: R44.2
SDRAM_D22: R42.2
SDRAM_D23: R40.2
SDRAM_D24: R38.2
SDRAM_D25: R36.2
SDRAM_D26: R34.2
SDRAM_D27: R32.2
SDRAM_D28: R30.2
SDRAM_D29: R28.2
SDRAM_D30: R26.2
SDRAM_D31: R24.2
SDRAM_NBL0: R71.1 ; port SDRAM.SDRAM_NBL0
SDRAM_NBL1: R69.1 ; port SDRAM.SDRAM_NBL1
SDRAM_NBL2: R67.1 ; port SDRAM.SDRAM_NBL2
SDRAM_NBL3: R65.1 ; port SDRAM.SDRAM_NBL3
SDRAM_R_A0: R45.2 U2.G8(A0)
SDRAM_R_A1: R43.2 U2.G9(A1)
SDRAM_R_A2: R41.2 U2.F7(A2)
SDRAM_R_A3: R39.2 U2.F3(A3)
SDRAM_R_A4: R37.2 U2.G1(A4)
SDRAM_R_A5: R35.2 U2.G2(A5)
SDRAM_R_A6: R33.2 U2.G3(A6)
SDRAM_R_A7: R31.2 U2.H2(A8)
SDRAM_R_A8: R29.2 U2.H1(A7)
SDRAM_R_A9: R27.2 U2.J3(A9)
SDRAM_R_A10: R25.2 U2.G7(A10)
SDRAM_R_A11: R23.2 U2.H9(A11)
SDRAM_R_BA0: R50.2 U2.J7(BA0)
SDRAM_R_BA1: R48.2 U2.H8(BA1)
SDRAM_R_NBL0: R71.2 U2.K9(DQM0)
SDRAM_R_NBL1: R69.2 U2.K1(DQM1)
SDRAM_R_NBL2: R67.2 U2.F8(DQM2)
SDRAM_R_NBL3: R65.2 U2.F2(DQM3)
SDRAM_R_SDCKE1: R60.2 U2.J2(CKE)
SDRAM_R_SDCLK: R62.2 U2.J1(CLK)
SDRAM_R_SDNCAS: R54.2 U2.K7(~{CAS})
SDRAM_R_SDNE1: R58.2 U2.J8(~{CS})
SDRAM_R_SDNRAS: R56.2 U2.J9(~{RAS})
SDRAM_R_SDNWE: R53.2 U2.K8(~{WE})
SDRAM_SDCKE1: R60.1 ; port SDRAM.SDRAM_SDCKE1
SDRAM_SDCLK: R62.1 ; port SDRAM.SDRAM_CLK
SDRAM_SDNCAS: R54.1 ; port SDRAM.SDRAM__SDNCAS
SDRAM_SDNE1: R58.1 ; port SDRAM.SDRAM_SDNE1
SDRAM_SDNRAS: R56.1 ; port SDRAM.SDRAM__SDNRAS
SDRAM_SDNWE: R53.1 ; port SDRAM.SDRAM_NWE

Not connected (* = marked no-connect by the designer): U2 E3(NC_1)* E7(NC_2)* H3(NC_3)* H7(NC_4)* K2(NC_5)* K3(NC_6)*

### Buses and harness runs
bus SDRAM_A[0..11]
bus SDRAM_D[0..31]

### Notes on the sheet
- PG0
- PG1
- PI10
- PI9
- PF5
- PF12
- PF13
- PF14
- PF15
- PI7
- PI6
- PI3
- PI2
- PI1
- PF0
- PF1
- PF2
- PF3
- PF4
- PI0
- PH15
- PH14
- PH13
- PH12
- PH5
- PG4
- PG5
- PH11
- PH10
- PH9
- PH8
- PF11
- PH6
- PH7
- PG8
- PG15
- PE14
- PE15
- PD8
- PD9
- PD10
- PI4
- PI5
- PE1
- PE0
- PE9
- PE10
- PE11
- PE12
- PE13
- PE7
- PE8
- PD15
- PD0
- PD1
- PD14
- Project:
- BEE-PC1
- Sub-system:
- NANORACK_EXP_CONTROLLER
- Design by:
- SANG HUYNH
- BAO BUI Q.
- Sheet title:
- Sheet
- A3
- of
- Checked by:
- Approved by:
- VU PHAM
- Revision:
- Document No:
- V1.2.2
- Size:
- Date:

### Library data of the parts
C7-C20 = CAP_SMD: CAP_Chip; Value: 33pF
R23-R78 = _RES_B_2: RES
U2 = IS42S32400J-6BL: DRAM 128M, 3.3V, SDRAM, 4Mx32, 166Mhz, 90 ball BGA (8mmx13mm) RoHS; Manufacturer_Name: Integrated Silicon Solution Inc.; Geometry.Height: 1.2mm; Manufacturer_Part_Number: IS42S32400J-6BL; Mouser Part Number: *; Mouser Price/Stock: *; Arrow Part Number: IS42S32400J-6BL; Arrow Price/Stock: https://www.arrow.com/en/products/is42s32400j-6bl/integrated-silicon-solution-inc?utm_currency=USD&region=nac; Datasheet Link: https://www.issi.com/WW/pdf/42-45S32400J.pdf

## Sheet MRAM.SchDoc
size 420 x 297 mm; SheetNumber: 8; SheetTotal: 17
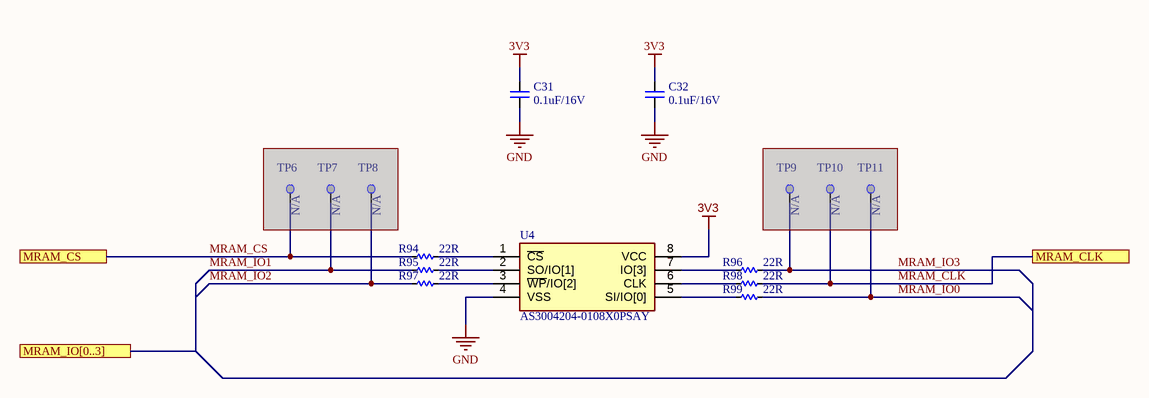
[diagram p7: MRAM.SchDoc]

### Parts
C31  0.1uF/16V  [CAP_C_1608X80]
C32  0.1uF/16V  [CAP_C_1608X80]
R94  22R  [RES_C_1608X60]
R95  22R  [RES_C_1608X60]
R96  22R  [RES_C_1608X60]
R97  22R  [RES_C_1608X60]
R98  22R  [RES_C_1608X60]
R99  22R  [RES_C_1608X60]
TP6  Test Point  [TESTPOINT]  (value not drawn)  (no BOM)  (masked out: inside a compile mask, not in the netlist)
TP7  Test Point  [TESTPOINT]  (value not drawn)  (no BOM)  (masked out: inside a compile mask, not in the netlist)
TP8  Test Point  [TESTPOINT]  (value not drawn)  (no BOM)  (masked out: inside a compile mask, not in the netlist)
TP9  Test Point  [TESTPOINT]  (value not drawn)  (no BOM)  (masked out: inside a compile mask, not in the netlist)
TP10  Test Point  [TESTPOINT]  (value not drawn)  (no BOM)  (masked out: inside a compile mask, not in the netlist)
TP11  Test Point  [TESTPOINT]  (value not drawn)  (no BOM)  (masked out: inside a compile mask, not in the netlist)
U4  AS3004204-0108X0PSAY  [SOIC127P790X216-8N]

### Ports
MRAM_CLK, MRAM_CS, MRAM_IO[0..3]

### Nets
3V3: C31.2 C32.2 U4.8(VCC)
GND: C31.1 C32.1 U4.4(VSS)
MRAM_CLK: R98.2 ; port MRAM_CLK
MRAM_CS: R94.1 ; port MRAM_CS
MRAM_IO0: R99.2
MRAM_IO1: R95.1
MRAM_IO2: R97.1
MRAM_IO3: R96.2
NetR94_2: R94.2 U4.1(~{CS})
NetR95_2: R95.2 U4.2(SO/IO[1])
NetR96_1: R96.1 U4.7(IO[3])
NetR97_2: R97.2 U4.3(~{WP}/IO[2])
NetR98_1: R98.1 U4.6(CLK)
NetR99_1: R99.1 U4.5(SI/IO[0])

### Notes on the sheet
- Project:
- BEE-PC1
- Sub-system:
- NANORACK_EXP_CONTROLLER
- Design by:
- SANG HUYNH
- BAO BUI Q.
- Sheet title:
- Sheet
- A3
- of
- Checked by:
- Approved by:
- VU PHAM
- Revision:
- Document No:
- V1.2.2
- Size:
- Date:

### Library data of the parts
C31 C32 = CAP_SMD: CAP_Chip; Value: 33pF
R94-R99 = _RES_B_2: RES
TP6-TP11 = MCD-00630: as TP1 on sheet POWER; Internal_Part_Number: MCD-00630; Status: Released; ECCN_US: n/a; ECCN_EU: n/a; Provided_By: n/a; Manufacturer: N/A; Manufacturer_Part_Number: N/A; Order_Code_Digikey: N/A; Order_Code_Farnell: N/A; Order_Code_RS: N/A; Value: N/A; ComponentLink1URL: http://tunmcdsvn.tun.st.com/Component_Documentation_Library/Trunk; Manufacturer_HQ_COO: Unknown
U4 = AS3004204-0108X0PSAY: MRAM Avalanche High Performance Serial P-SRAM 4Mb in SOIC8 package with QSPI - 108MHz interface, 3V, -40 C to 105 C; Manufacturer_Name: Avalanche Technology; Geometry.Height: 2.16mm; Manufacturer_Part_Number: AS3004204-0108X0PSAY; Mouser Part Number: 793-30042040108X0PSY; Mouser Price/Stock: https://www.mouser.co.uk/ProductDetail/Avalanche-Technology/AS3004204-0108X0PSAY/?qs=eP2BKZSCXI7G0ggegRejGg%3D%3D; Arrow Part Number: *; Arrow Price/Stock: *; Datasheet Link: https://www.mouser.ph/ProductDetail/Avalanche-Technology/AS3004204-0108X0PSAY?qs=eP2BKZSCXI7G0ggegRejGg%3D%3D

## Sheet LVDS.SchDoc
size 420 x 297 mm; DocumentNumber: 8; SheetNumber: 9; SheetTotal: 17
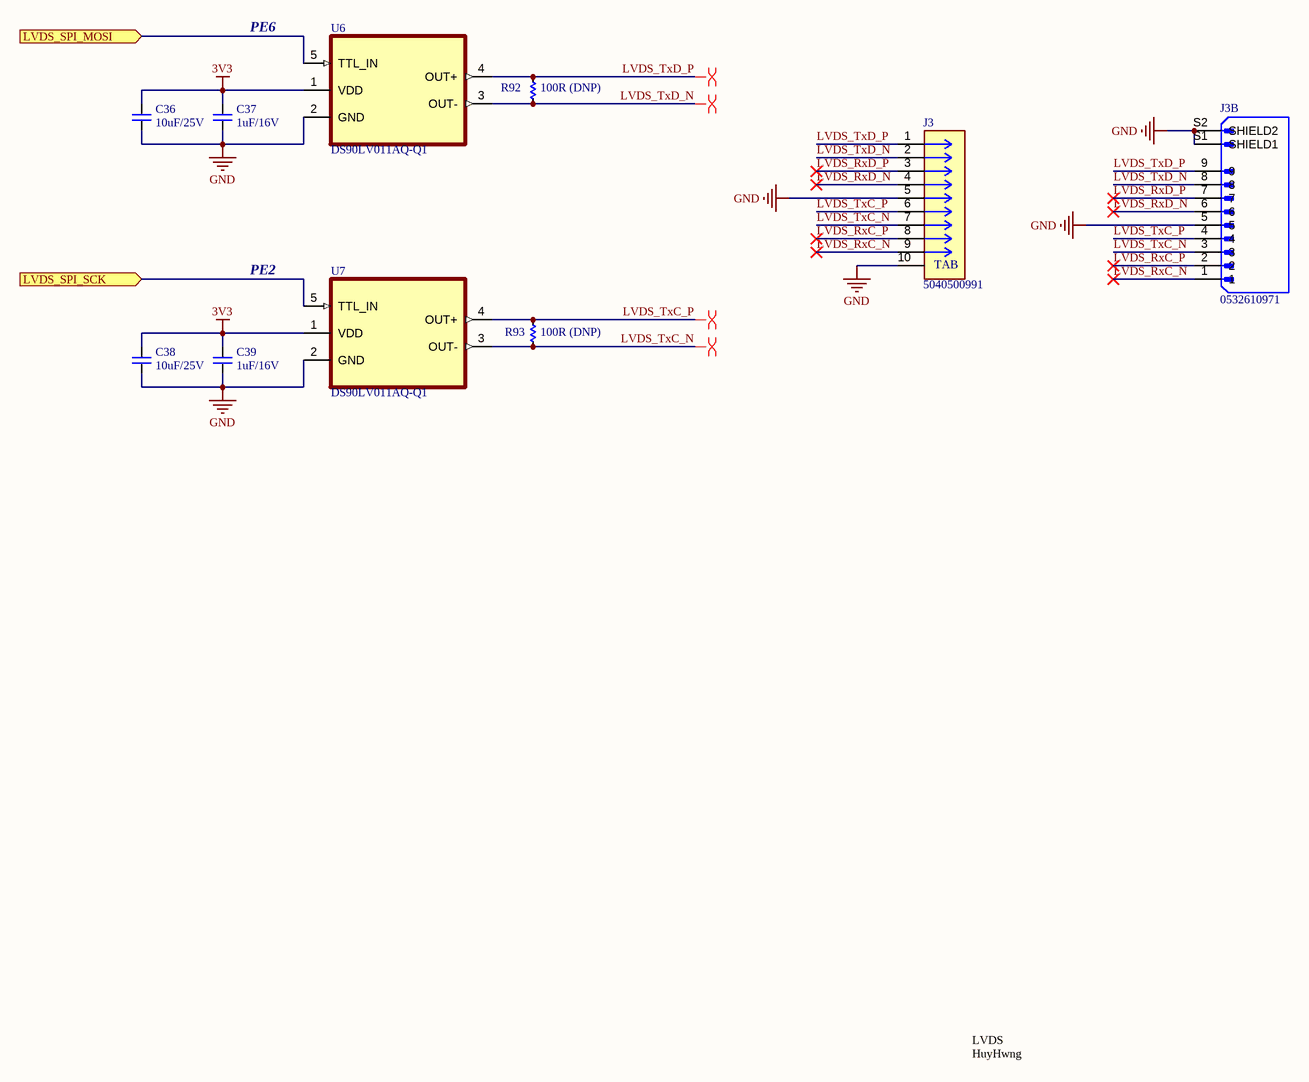
[diagram p8: LVDS.SchDoc]

### Parts
C36  10uF/25V  [CAP_C_1608X80]
C37  1uF/16V  [CAP_C_1608X80]
C38  10uF/25V  [CAP_C_1608X80]
C39  1uF/16V  [CAP_C_1608X80]
J3  5040500991  [5040500991]
J3B  0532610971  [0532610971]
R92  100R (DNP)  [RES_C_1608X60]
R93  100R (DNP)  [RES_C_1608X60]
U6  DS90LV011AQ-Q1  [DS90LV011AQ-Q1]
U7  DS90LV011AQ-Q1  [DS90LV011AQ-Q1]

### Ports
LVDS_SPI_MOSI (in), LVDS_SPI_SCK (in)

### Nets
3V3: C36.2 C37.2 C38.2 C39.2 U6.1(VDD) U7.1(VDD)
GND: C36.1 C37.1 C38.1 C39.1 J3.5 J3.10 J3B.5 J3B.S1(SHIELD1) J3B.S2(SHIELD2) U6.2(GND) U7.2(GND)
LVDS_RxC_N: J3.9 J3B.1
LVDS_RxC_P: J3.8 J3B.2
LVDS_RxD_N: J3.4 J3B.6
LVDS_RxD_P: J3.3 J3B.7
LVDS_SPI_MOSI: U6.5(TTL_IN) ; port LVDS_SPI_MOSI
LVDS_SPI_SCK: U7.5(TTL_IN) ; port LVDS_SPI_SCK
LVDS_TxC_N: J3.7 J3B.3 R93.1 U7.3(OUT-)
LVDS_TxC_P: J3.6 J3B.4 R93.2 U7.4(OUT+)
LVDS_TxD_N: J3.2 J3B.8 R92.1 U6.3(OUT-)
LVDS_TxD_P: J3.1 J3B.9 R92.2 U6.4(OUT+)

### Layout directives
differential pair: LVDS_TxC_N, LVDS_TxC_P, LVDS_TxD_N, LVDS_TxD_P

### Notes on the sheet
- PE6
- PE2
- LVDS
- HuyHwng
- Project:
- BEE-PC1
- Sub-system:
- NANORACK_EXP_CONTROLLER
- Design by:
- SANG HUYNH
- BAO BUI Q.
- Sheet title:
- Sheet
- A3
- of
- Checked by:
- Approved by:
- VU PHAM
- Revision:
- Document No:
- V1.2.2
- Size:
- Date:
- (in symbol 5040500991) TAB

### Library data of the parts
C36-C39 = CAP_SMD: CAP_Chip; Value: 33pF
J3 = 5040500991: as J2 on sheet CONNECTOR
J3B = CONN_SMD_09: CONN HEADER SMD R/A 9POS 1.25MM
R92 R93 = _RES_B_2: RES
U6 U7 = DS90LV011AQ-Q1: Automotive LVDS Differential Driver

## Sheet CAN.SchDoc
size 420 x 297 mm; DocumentNumber: 9; SheetNumber: 10; SheetTotal: 17
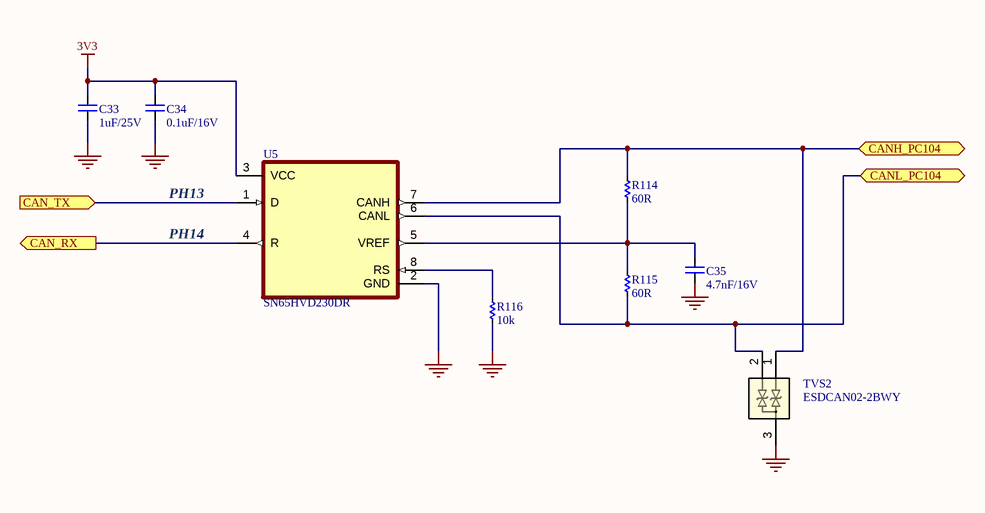
[diagram p9: CAN.SchDoc]

### Parts
C33  1uF/25V  [CAP_C_1608X80]
C34  0.1uF/16V  [CAP_C_1608X80]
C35  4.7nF/16V  [CAP_C_1608X80]
R114  60R  [RES_C_1608X60]
R115  60R  [RES_C_1608X60]
R116  10k  [RES_C_1608X60]
TVS2  ESDCAN02-2BWY  [SOT323-3L_STM]
U5  SN65HVD230DR  [SOIC127P599X175-8N]

### Ports
CAN_RX (out), CAN_TX (in), CANH_PC104 (bidir), CANL_PC104 (bidir)

### Nets
3V3: C33.1 C34.1 U5.3(VCC)
GND: C33.2 C34.2 C35.2 R116.1 TVS2.3 U5.2(GND)
CAN_RX: U5.4(R) ; port CAN_RX
CAN_TX: U5.1(D) ; port CAN_TX
NetC35_1: C35.1 R114.1 R115.2 U5.5(VREF)
NetJ2_3: R114.2 TVS2.1 U5.7(CANH) ; port CANH_PC104
NetJ2_4: R115.1 TVS2.2 U5.6(CANL) ; port CANL_PC104
NetR116_2: R116.2 U5.8(RS)

### Notes on the sheet
- PH13
- PH14
- Project:
- BEE-PC1
- Sub-system:
- NANORACK_EXP_CONTROLLER
- Design by:
- SANG HUYNH
- BAO BUI Q.
- Sheet title:
- Sheet
- A3
- of
- Checked by:
- Approved by:
- VU PHAM
- Revision:
- Document No:
- V1.2.2
- Size:
- Date:

### Library data of the parts
C33-C35 = CAP_SMD: CAP_Chip; Value: 33pF
R114-R116 = _RES_B_2: RES
TVS2 = ESDCAN02-2BWY: Automotive dual-line TVS in SOT323-3L for CAN bus (12 V system); Manufacturer_Name: STMicroelectronics; Copyright: Copyright (C) 2025 Ultra Librarian. All rights reserved.; Manufacturer_Part_Number: ESDCAN02-2BWY; RefDes: RefDes; Type: Type
U5 = SN65HVD230DR: 3.3 V CAN Transceiver with Standby Mode; MF: Texas Instruments; SnapEDA_Link: https://www.snapeda.com/parts/SN65HVD230DR/Texas+Instruments/view-part/?ref=snap; Package: SOIC-8 Texas Instruments; Value: *; MP: SN65HVD230DR; Check_prices: https://www.snapeda.com/parts/SN65HVD230DR/Texas+Instruments/view-part/?ref=eda

## Sheet I2C.SchDoc
size 420 x 297 mm; DocumentNumber: 10; SheetNumber: 11; SheetTotal: 17
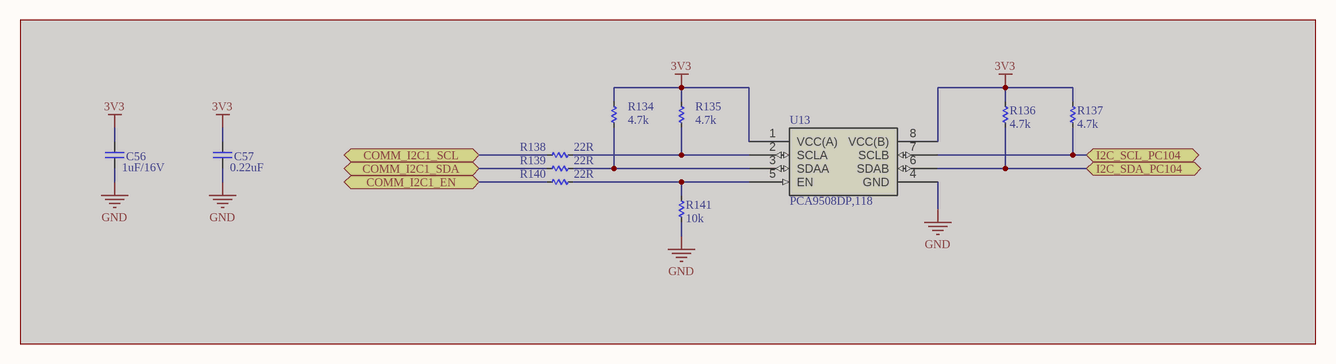
[diagram p10: I2C.SchDoc]

### Parts
C56  1uF/16V  [CAP_C_1608X80]  (masked out: inside a compile mask, not in the netlist)
C57  0.22uF  [CAP_C_1608X80]  (masked out: inside a compile mask, not in the netlist)
R134  4.7k  [RES_C_1608X60]  (masked out: inside a compile mask, not in the netlist)
R135  4.7k  [RES_C_1608X60]  (masked out: inside a compile mask, not in the netlist)
R136  4.7k  [RES_C_1608X60]  (masked out: inside a compile mask, not in the netlist)
R137  4.7k  [RES_C_1608X60]  (masked out: inside a compile mask, not in the netlist)
R138  22R  [RES_C_1608X60]  (masked out: inside a compile mask, not in the netlist)
R139  22R  [RES_C_1608X60]  (masked out: inside a compile mask, not in the netlist)
R140  22R  [RES_C_1608X60]  (masked out: inside a compile mask, not in the netlist)
R141  10k  [RES_C_1608X60]  (masked out: inside a compile mask, not in the netlist)
U13  PCA9508DP,118  [TSSOP8_SOT505-1_NXP]  (masked out: inside a compile mask, not in the netlist)

### Ports
COMM_I2C1_EN (bidir), COMM_I2C1_SCL (bidir), COMM_I2C1_SDA (bidir), I2C_SCL_PC104 (bidir), I2C_SDA_PC104 (bidir)

### Notes on the sheet
- Project:
- BEE-PC1
- Sub-system:
- NANORACK_EXP_CONTROLLER
- Design by:
- SANG HUYNH
- BAO BUI Q.
- Sheet title:
- Sheet
- A3
- of
- Checked by:
- Approved by:
- VU PHAM
- Revision:
- Document No:
- V1.2.2
- Size:
- Date:

### Library data of the parts
C56 C57 = CAP_SMD: CAP_Chip; Value: 33pF
R134-R141 = _RES_B_2: RES
U13 = PCA9508DP,118: No Description Available; Manufacturer_Name: NXP; Copyright: Copyright (C) 2025 Ultra Librarian. All rights reserved.; Manufacturer_Part_Number: PCA9508DP,118; RefDes: RefDes; Type: Type

## Sheet FRAM.SchDoc
size 420 x 297 mm; DocumentNumber: 12; SheetNumber: 12; SheetTotal: 17
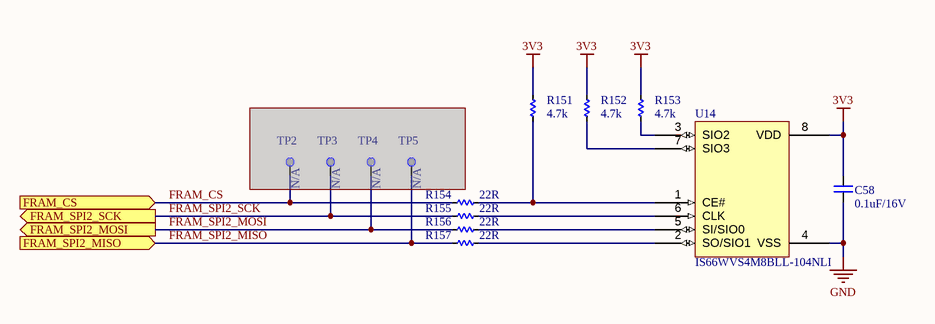
[diagram p11: FRAM.SchDoc]

### Parts
C58  0.1uF/16V  [CAP_C_1608X80]
R151  4.7k  [RES_C_1608X60]
R152  4.7k  [RES_C_1608X60]
R153  4.7k  [RES_C_1608X60]
R154  22R  [RES_C_1608X60]
R155  22R  [RES_C_1608X60]
R156  22R  [RES_C_1608X60]
R157  22R  [RES_C_1608X60]
TP2  Test Point  [TESTPOINT]  (value not drawn)  (no BOM)  (masked out: inside a compile mask, not in the netlist)
TP3  Test Point  [TESTPOINT]  (value not drawn)  (no BOM)  (masked out: inside a compile mask, not in the netlist)
TP4  Test Point  [TESTPOINT]  (value not drawn)  (no BOM)  (masked out: inside a compile mask, not in the netlist)
TP5  Test Point  [TESTPOINT]  (value not drawn)  (no BOM)  (masked out: inside a compile mask, not in the netlist)
U14  IS66WVS4M8BLL-104NLI  [SOIC8_150MIL_N_ISI]

### Ports
FRAM_CS (in), FRAM_SPI2_MISO (in), FRAM_SPI2_MOSI (out), FRAM_SPI2_SCK (out)

### Nets
3V3: C58.2 R151.2 R152.2 R153.2 U14.8(VDD)
GND: C58.1 U14.4(VSS)
FRAM_CS: R154.1 ; port FRAM_CS
FRAM_SPI2_MISO: R157.1 ; port FRAM_SPI2_MISO
FRAM_SPI2_MOSI: R156.1 ; port FRAM_SPI2_MOSI
FRAM_SPI2_SCK: R155.1 ; port FRAM_SPI2_SCK
NetR151_1: R151.1 R154.2 U14.1(CE#)
NetR152_1: R152.1 U14.7(SIO3)
NetR153_1: R153.1 U14.3(SIO2)
NetR155_2: R155.2 U14.6(CLK)
NetR156_2: R156.2 U14.5(SI/SIO0)
NetR157_2: R157.2 U14.2(SO/SIO1)

### Notes on the sheet
- Project:
- BEE-PC1
- Sub-system:
- NANORACK_EXP_CONTROLLER
- Design by:
- SANG HUYNH
- BAO BUI Q.
- Sheet title:
- Sheet
- A3
- of
- Checked by:
- Approved by:
- VU PHAM
- Revision:
- Document No:
- V1.2.2
- Size:
- Date:

### Library data of the parts
C58 = CAP_SMD: CAP_Chip; Value: 33pF
R151-R157 = _RES_B_2: RES
TP2-TP5 = MCD-00630: as TP1 on sheet POWER; Internal_Part_Number: MCD-00630; Status: Released; ECCN_US: n/a; ECCN_EU: n/a; Provided_By: n/a; Manufacturer: N/A; Manufacturer_Part_Number: N/A; Order_Code_Digikey: N/A; Order_Code_Farnell: N/A; Order_Code_RS: N/A; Value: N/A; ComponentLink1URL: http://tunmcdsvn.tun.st.com/Component_Documentation_Library/Trunk; Manufacturer_HQ_COO: Unknown
U14 = IS66WVS4M8BLL-104NLI: No Description Available; Manufacturer_Name: ISSI; Type: Memory; Copyright: Copyright (C) 2025 Ultra Librarian. All rights reserved.; Manufacturer_Part_Number: IS66WVS4M8BLL-104NLI; RefDes: RefDes

## Sheet TEMP_CTRL.SchDoc
size 420 x 297 mm; SheetNumber: 13; SheetTotal: 17
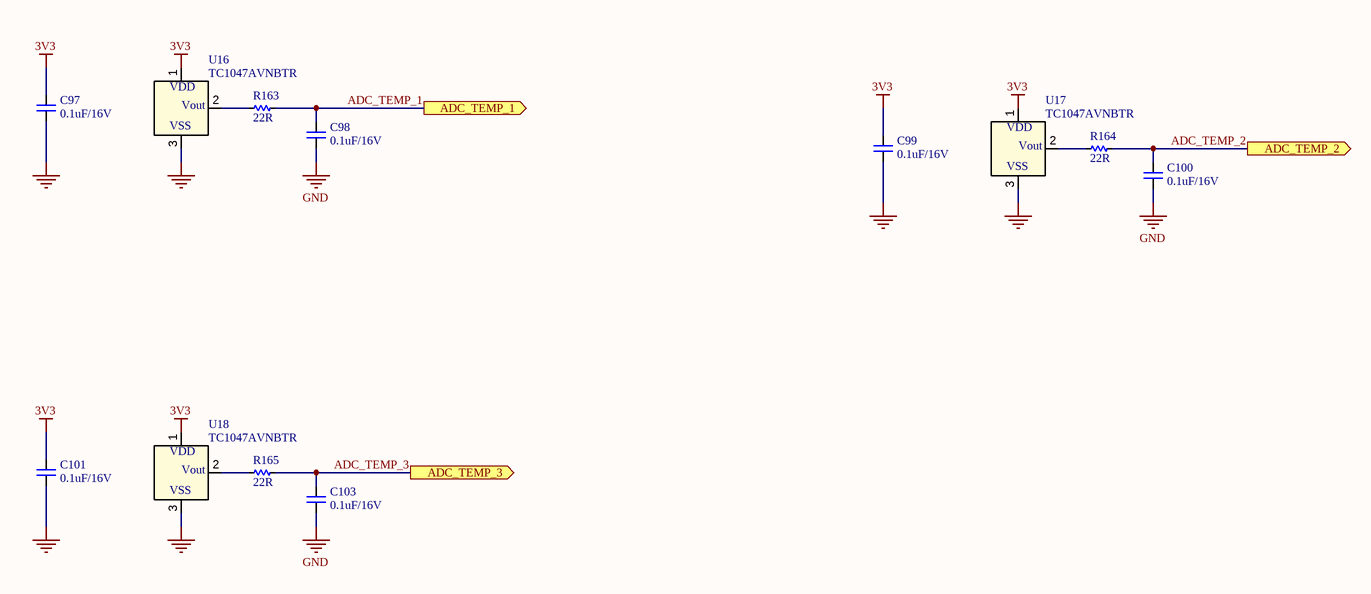
[diagram p12: TEMP_CTRL.SchDoc]

### Parts
C97  0.1uF/16V  [CAP_C_1608X80]
C98  0.1uF/16V  [CAP_C_1608X80]
C99  0.1uF/16V  [CAP_C_1608X80]
C100  0.1uF/16V  [CAP_C_1608X80]
C101  0.1uF/16V  [CAP_C_1608X80]
C103  0.1uF/16V  [CAP_C_1608X80]
R163  22R  [RES_C_1608X60]
R164  22R  [RES_C_1608X60]
R165  22R  [RES_C_1608X60]
U16  TC1047AVNBTR  [SOT-23_MC_MCH]
U17  TC1047AVNBTR  [SOT-23_MC_MCH]
U18  TC1047AVNBTR  [SOT-23_MC_MCH]

### Ports
ADC_TEMP_1 (out), ADC_TEMP_2 (out), ADC_TEMP_3 (out)

### Nets
3V3: C97.2 C99.2 C101.2 U16.1(VDD) U17.1(VDD) U18.1(VDD)
GND: C97.1 C98.1 C99.1 C100.1 C101.1 C103.1 U16.3(VSS) U17.3(VSS) U18.3(VSS)
ADC_TEMP_1: C98.2 R163.2 ; port ADC_TEMP_1
ADC_TEMP_2: C100.2 R164.2 ; port ADC_TEMP_2
ADC_TEMP_3: C103.2 R165.2 ; port ADC_TEMP_3
NetR163_1: R163.1 U16.2(VOUT)
NetR164_1: R164.1 U17.2(VOUT)
NetR165_1: R165.1 U18.2(VOUT)

### Notes on the sheet
- Project:
- BEE-PC1
- Sub-system:
- NANORACK_EXP_CONTROLLER
- Design by:
- SANG HUYNH
- BAO BUI Q.
- Sheet title:
- Sheet
- A3
- of
- Checked by:
- Approved by:
- VU PHAM
- Revision:
- Document No:
- V1.2.2
- Size:
- Date:
- (in symbol TC1047AVNBTR) Vout

### Library data of the parts
C97-C101 C103 = CAP_SMD: CAP_Chip; Value: 33pF
R163-R165 = _RES_B_2: RES
U16-U18 = TC1047AVNBTR: No Description Available; Manufacturer_Name: Microchip; Copyright: Copyright (C) 2025 Ultra Librarian. All rights reserved.; Manufacturer_Part_Number: TC1047AVNBTR; RefDes: RefDes; Type: Type

## Sheet WATCHDOG.SchDoc
size 420 x 297 mm; DocumentNumber: 13; SheetNumber: 14; SheetTotal: 17
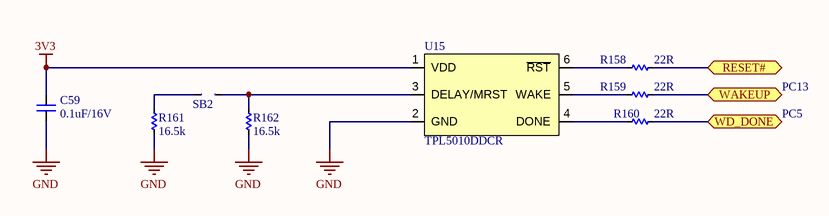
[diagram p13: WATCHDOG.SchDoc]

### Parts
C59  0.1uF/16V  [CAP_C_1608X80]
R158  22R  [RES_C_1608X60]
R159  22R  [RES_C_1608X60]
R160  22R  [RES_C_1608X60]
R161  16.5k  [RES_C_1608X60]
R162  16.5k  [RES_C_1608X60]
SB2  JUMPER  [JUMPER_1608]  (value not drawn)
U15  TPL5010DDCR  [TPL5010DDCR]

### Ports
RESET# (bidir), WAKEUP (bidir), WD_DONE (bidir)

### Nets
3V3: C59.2 U15.1(VDD)
GND: C59.1 R161.1 R162.1 U15.2(GND)
RESET#: R158.2 ; port RESET#
WAKEUP: R159.2 ; port WAKEUP
WD_DONE: R160.2 ; port WD_DONE
NetR158_1: R158.1 U15.6(~{RST})
NetR159_1: R159.1 U15.5(WAKE)
NetR160_1: R160.1 U15.4(DONE)
NetR161_2: R161.2 SB2.1
NetR162_2: R162.2 SB2.2 U15.3(DELAY/MRST)

### Notes on the sheet
- PC13
- PC5
- Project:
- BEE-PC1
- Sub-system:
- NANORACK_EXP_CONTROLLER
- Design by:
- SANG HUYNH
- BAO BUI Q.
- Sheet title:
- Sheet
- A3
- of
- Checked by:
- Approved by:
- VU PHAM
- Revision:
- Document No:
- V1.2.2
- Size:
- Date:

### Library data of the parts
C59 = CAP_SMD: CAP_Chip; Value: 33pF
R158-R162 = _RES_B_2: RES
U15 = TPL5010DDCR: OSC PROG TIMER TSOT23-6

## Sheet DEBUG.SchDoc
size 420 x 297 mm; DocumentNumber: 14; SheetNumber: 15; SheetTotal: 17
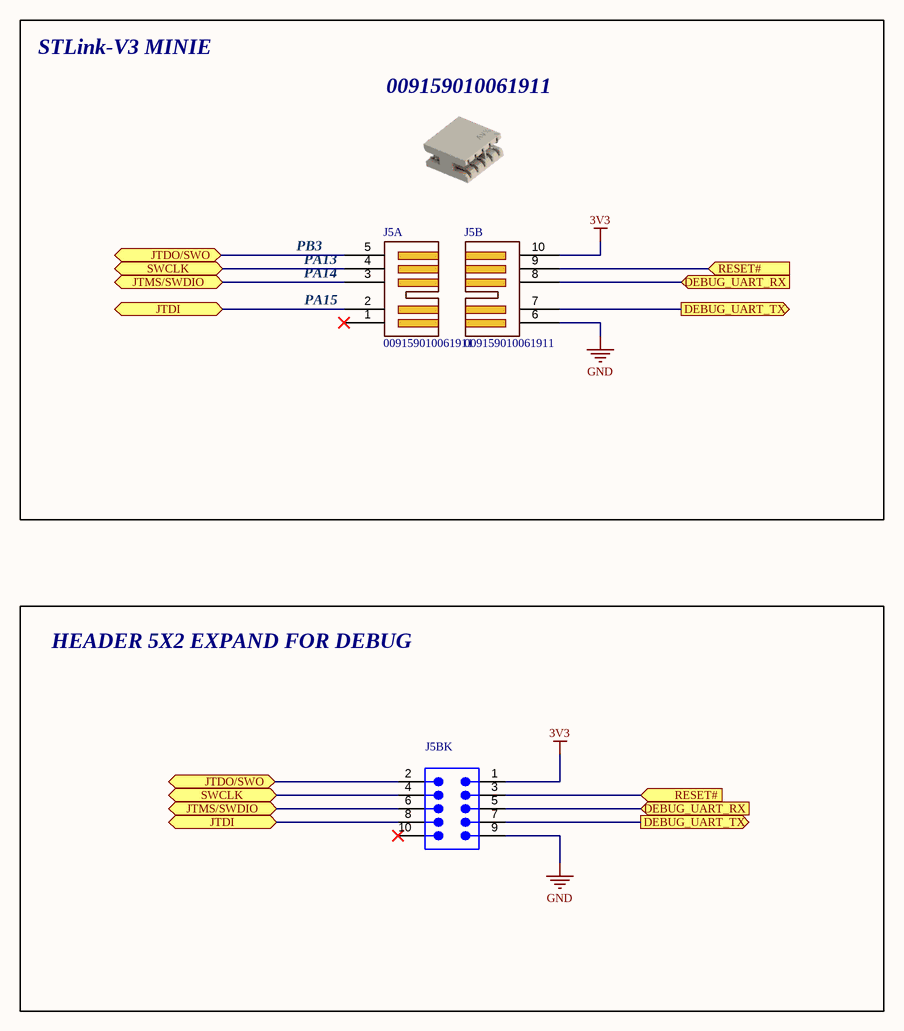
[diagram p14: DEBUG.SchDoc]

### Parts
J5  009159010061911  [009159010061911]  (parts A,B of 2)
J5BK  61301021121  [61301021121]  (value not drawn)

### Blocks framed on the sheet
HEADER 5X2 EXPAND FOR DEBUG: J5BK

### Ports
DEBUG_UART_RX (in), DEBUG_UART_TX (out), JTDI (bidir), JTDO/SWO (bidir), JTMS/SWDIO (bidir), RESET# (in), SWCLK (bidir)

### Nets
3V3: J5.10 J5BK.1
GND: J5.6 J5BK.9
DEBUG_UART_RX: J5.8 J5BK.5 ; port DEBUG_UART_RX
DEBUG_UART_TX: J5.7 J5BK.7 ; port DEBUG_UART_TX
JTCK/SWCLK: J5.4 J5BK.4 ; port SWCLK
JTDI: J5.2 J5BK.8 ; port JTDI
JTDO/SWO: J5.5 J5BK.2 ; port JTDO/SWO
JTMS/SWDIO: J5.3 J5BK.6 ; port JTMS/SWDIO
RESET#: J5.9 J5BK.3 ; port RESET#

Not connected (* = marked no-connect by the designer): J5 1*; J5BK 10*

### Notes on the sheet
- STLink-V3 MINIE
- 009159010061911
- PB3
- PA13
- PA14
- PA15
- Project:
- BEE-PC1
- Sub-system:
- NANORACK_EXP_CONTROLLER
- Design by:
- SANG HUYNH
- BAO BUI Q.
- Sheet title:
- Sheet
- A3
- of
- Checked by:
- Approved by:
- VU PHAM
- Revision:
- Document No:
- V1.2.2
- Size:
- Date:

### Library data of the parts
J5 = 009159010061911: pads for STLink V3 minie
J5BK = 61301021121: WR-PHD Pin Header, THT, Vertical, pitch 2.54mm, 2 Row, 10P; Manufacturer: Wurth Elektronik; Contact Resistance: 20mOhm; Rated Current: 3A; Working Voltage: 250V; Withstanding Voltage: 500V; Manufacturer Part Number: 61301021121; Category: Board-to-Board Connectors; Match Code: WR-PHD; ComponentLink1Description: Website Link; ComponentLink1URL: https://www.we-online.com/redexpert/article/61301021121?ad; ComponentLink2Description: Datasheet Link; ComponentLink2URL: https://www.we-online.com/redexpert/spec/61301021121?ad; Mount: Through Hole; Operating Temperature Max: 105°C; Operating Temperature Min: -40°C; Packaging: Bag; Gender: Pin Header; Number of Pins: 10; Number of Rows: 2; Orientation: Vertical; Pitch: 2.54mm

## Sheet MCU_POWER.SchDoc: STM32 microcontroller Power
size 420 x 297 mm; CompanyName: STMicroelectronics; Organization: Microcontrollers Division; DocumentNumber: 15; SheetNumber: 16; SheetTotal: 17
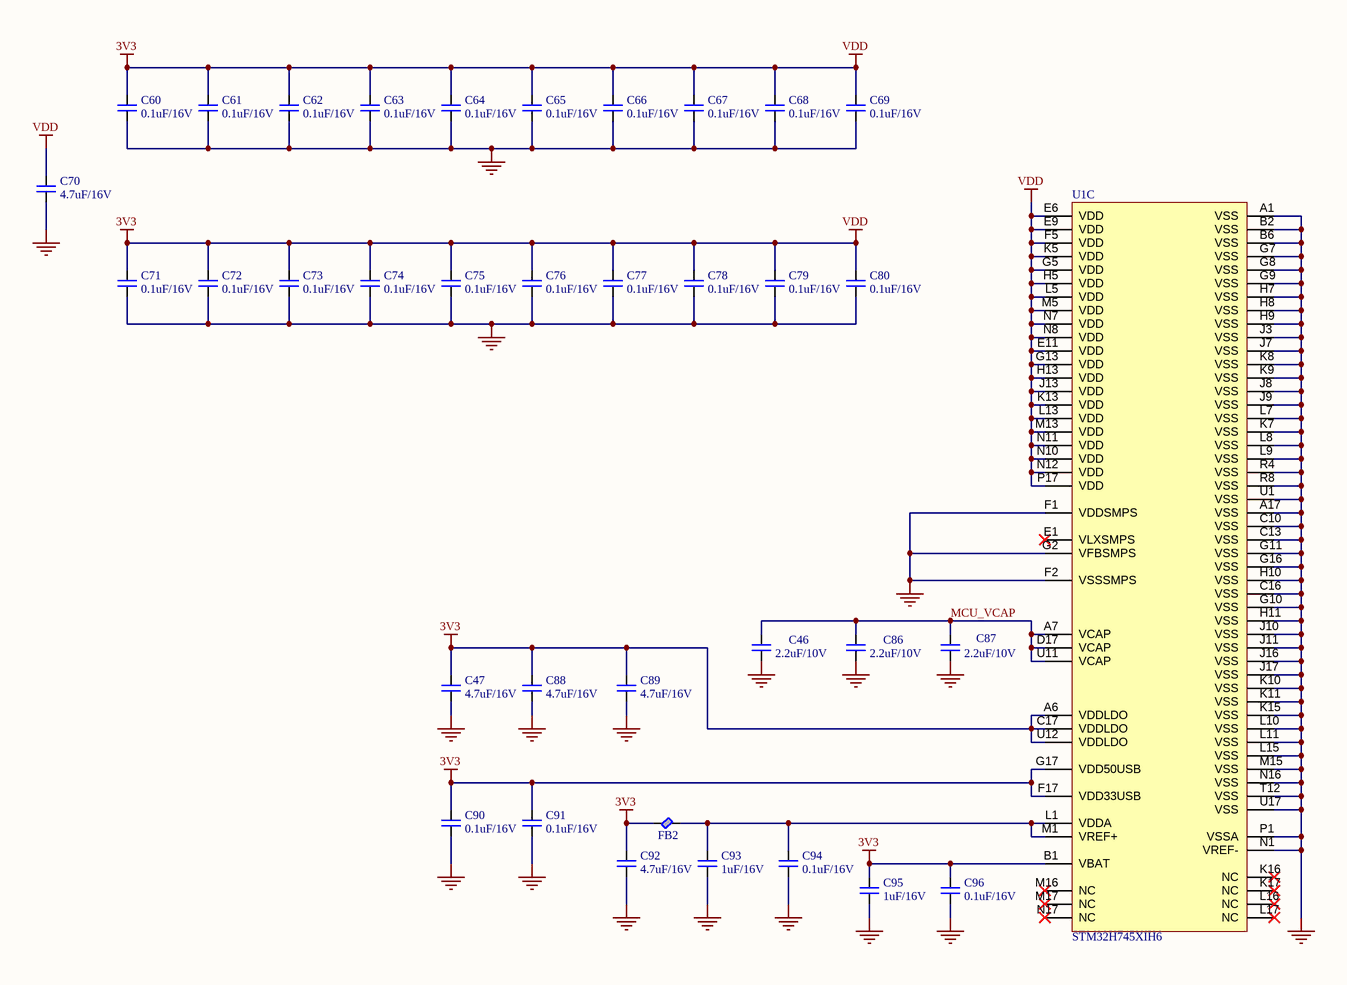
[diagram p15: MCU_POWER.SchDoc]

### Parts
C46  2.2uF/10V  [CAP_C_1608X80]
C47  4.7uF/16V  [CAP_C_1608X80]
C60  0.1uF/16V  [CAP_C_1608X80]
C61  0.1uF/16V  [CAP_C_1608X80]
C62  0.1uF/16V  [CAP_C_1608X80]
C63  0.1uF/16V  [CAP_C_1608X80]
C64  0.1uF/16V  [CAP_C_1608X80]
C65  0.1uF/16V  [CAP_C_1608X80]
C66  0.1uF/16V  [CAP_C_1608X80]
C67  0.1uF/16V  [CAP_C_1608X80]
C68  0.1uF/16V  [CAP_C_1608X80]
C69  0.1uF/16V  [CAP_C_1608X80]
C70  4.7uF/16V  [CAP_C_1608X80]
C71  0.1uF/16V  [CAP_C_1608X80]
C72  0.1uF/16V  [CAP_C_1608X80]
C73  0.1uF/16V  [CAP_C_1608X80]
C74  0.1uF/16V  [CAP_C_1608X80]
C75  0.1uF/16V  [CAP_C_1608X80]
C76  0.1uF/16V  [CAP_C_1608X80]
C77  0.1uF/16V  [CAP_C_1608X80]
C78  0.1uF/16V  [CAP_C_1608X80]
C79  0.1uF/16V  [CAP_C_1608X80]
C80  0.1uF/16V  [CAP_C_1608X80]
C86  2.2uF/10V  [CAP_C_1608X80]
C87  2.2uF/10V  [CAP_C_1608X80]
C88  4.7uF/16V  [CAP_C_1608X80]
C89  4.7uF/16V  [CAP_C_1608X80]
C90  0.1uF/16V  [CAP_C_1608X80]
C91  0.1uF/16V  [CAP_C_1608X80]
C92  4.7uF/16V  [CAP_C_1608X80]
C93  1uF/16V  [CAP_C_1608X80]
C94  0.1uF/16V  [CAP_C_1608X80]
C95  1uF/16V  [CAP_C_1608X80]
C96  0.1uF/16V  [CAP_C_1608X80]
FB2  BLM18PG121SN1D  [IND_1608x65]  (value not drawn)
U1  STM32H745XIH6  [BGA265C80P17X17_1400X1400X110N]  (part C of 3)

### Nets
3V3: C47.1 C60.2 C61.2 C62.2 C63.2 C64.2 C65.2 C66.2 C67.2 C68.2 C69.2 C70.1 C71.2 C72.2 C73.2 C74.2 C75.2 C76.2 C77.2 C78.2 C79.2 C80.2 C88.1 C89.1 C90.2 C91.2 C92.1 C95.2 C96.2 FB2.1 U1.A6(VDDLDO) U1.B1(VBAT) U1.C17(VDDLDO) U1.E6(VDD) U1.E9(VDD) U1.E11(VDD) U1.F5(VDD) U1.F17(VDD33USB) U1.G5(VDD) U1.G13(VDD) U1.G17(VDD50USB) U1.H5(VDD) U1.H13(VDD) U1.J13(VDD) U1.K5(VDD) U1.K13(VDD) U1.L5(VDD) U1.L13(VDD) U1.M5(VDD) U1.M13(VDD) U1.N7(VDD) U1.N8(VDD) U1.N10(VDD) U1.N11(VDD) U1.N12(VDD) U1.P17(VDD) U1.U12(VDDLDO)  [also labelled VDD]
GND: C46.1 C47.2 C60.1 C61.1 C62.1 C63.1 C64.1 C65.1 C66.1 C67.1 C68.1 C69.1 C70.2 C71.1 C72.1 C73.1 C74.1 C75.1 C76.1 C77.1 C78.1 C79.1 C80.1 C86.1 C87.1 C88.2 C89.2 C90.1 C91.1 C92.2 C93.1 C94.1 C95.1 C96.1 U1.A1(VSS) U1.A17(VSS) U1.B2(VSS) U1.B6(VSS) U1.C10(VSS) U1.C13(VSS) U1.C16(VSS) U1.F1(VDDSMPS) U1.F2(VSSSMPS) U1.G2(VFBSMPS) U1.G7(VSS) U1.G8(VSS) U1.G9(VSS) U1.G10(VSS) U1.G11(VSS) U1.G16(VSS) U1.H7(VSS) U1.H8(VSS) U1.H9(VSS) U1.H10(VSS) U1.H11(VSS) U1.J3(VSS) U1.J7(VSS) U1.J8(VSS) U1.J9(VSS) U1.J10(VSS) U1.J11(VSS) U1.J16(VSS) U1.J17(VSS) U1.K7(VSS) U1.K8(VSS) U1.K9(VSS) U1.K10(VSS) U1.K11(VSS) U1.K15(VSS) U1.L7(VSS) U1.L8(VSS) U1.L9(VSS) U1.L10(VSS) U1.L11(VSS) U1.L15(VSS) U1.M15(VSS) U1.N1(VREF-) U1.N16(VSS) U1.P1(VSSA) U1.R4(VSS) U1.R8(VSS) U1.T12(VSS) U1.U1(VSS) U1.U17(VSS)
MCU_VCAP: C46.2 C86.2 C87.2 U1.A7(VCAP) U1.D17(VCAP) U1.U11(VCAP)
NetC93_2: C93.2 C94.2 FB2.2 U1.L1(VDDA) U1.M1(VREF+)

Not connected (* = marked no-connect by the designer): U1 E1(VLXSMPS)* K16(NC)* K17(NC)* L16(NC)* L17(NC)* M16(NC)* M17(NC)* N17(NC)*

### Notes on the sheet
- Project:
- BEE-PC1
- Sub-system:
- NANORACK_EXP_CONTROLLER
- Design by:
- SANG HUYNH
- BAO BUI Q.
- Sheet title:
- Sheet
- A3
- of
- Checked by:
- Approved by:
- VU PHAM
- Revision:
- Document No:
- V1.2.2
- Size:
- Date:

### Library data of the parts
C46 C47 C60-C80 C86-C96 = CAP_SMD: CAP_Chip; Value: 33pF
FB2 = FB: FERRITE BEAD
U1 = STM32H745XIH6: High-performance and DSP with DP-FPU, Arm Cortex-M7 + Cortex-M4 MCU with 2MBytes of Flash memory, 1MB RAM, 480 MHz CPU, Art Accelerator, L1 cache, external memory interface, large set of peripherals, SMPS; Manufacturer_Name: STMicroelectronics; Copyright: Copyright (C) 2025 Ultra Librarian. All rights reserved.; Manufacturer_Part_Number: STM32H745XIH6; Datasheet: https://www.st.com/resource/en/datasheet/stm32h745zg.pdf; RefDes: RefDes; Type: Type

## Sheet MCU.SchDoc: STM32 microcontroller IOs
size 420 x 297 mm; CompanyName: STMicroelectronics; Organization: Microcontrollers Division; DocumentNumber: 16; SheetNumber: 17; SheetTotal: 17
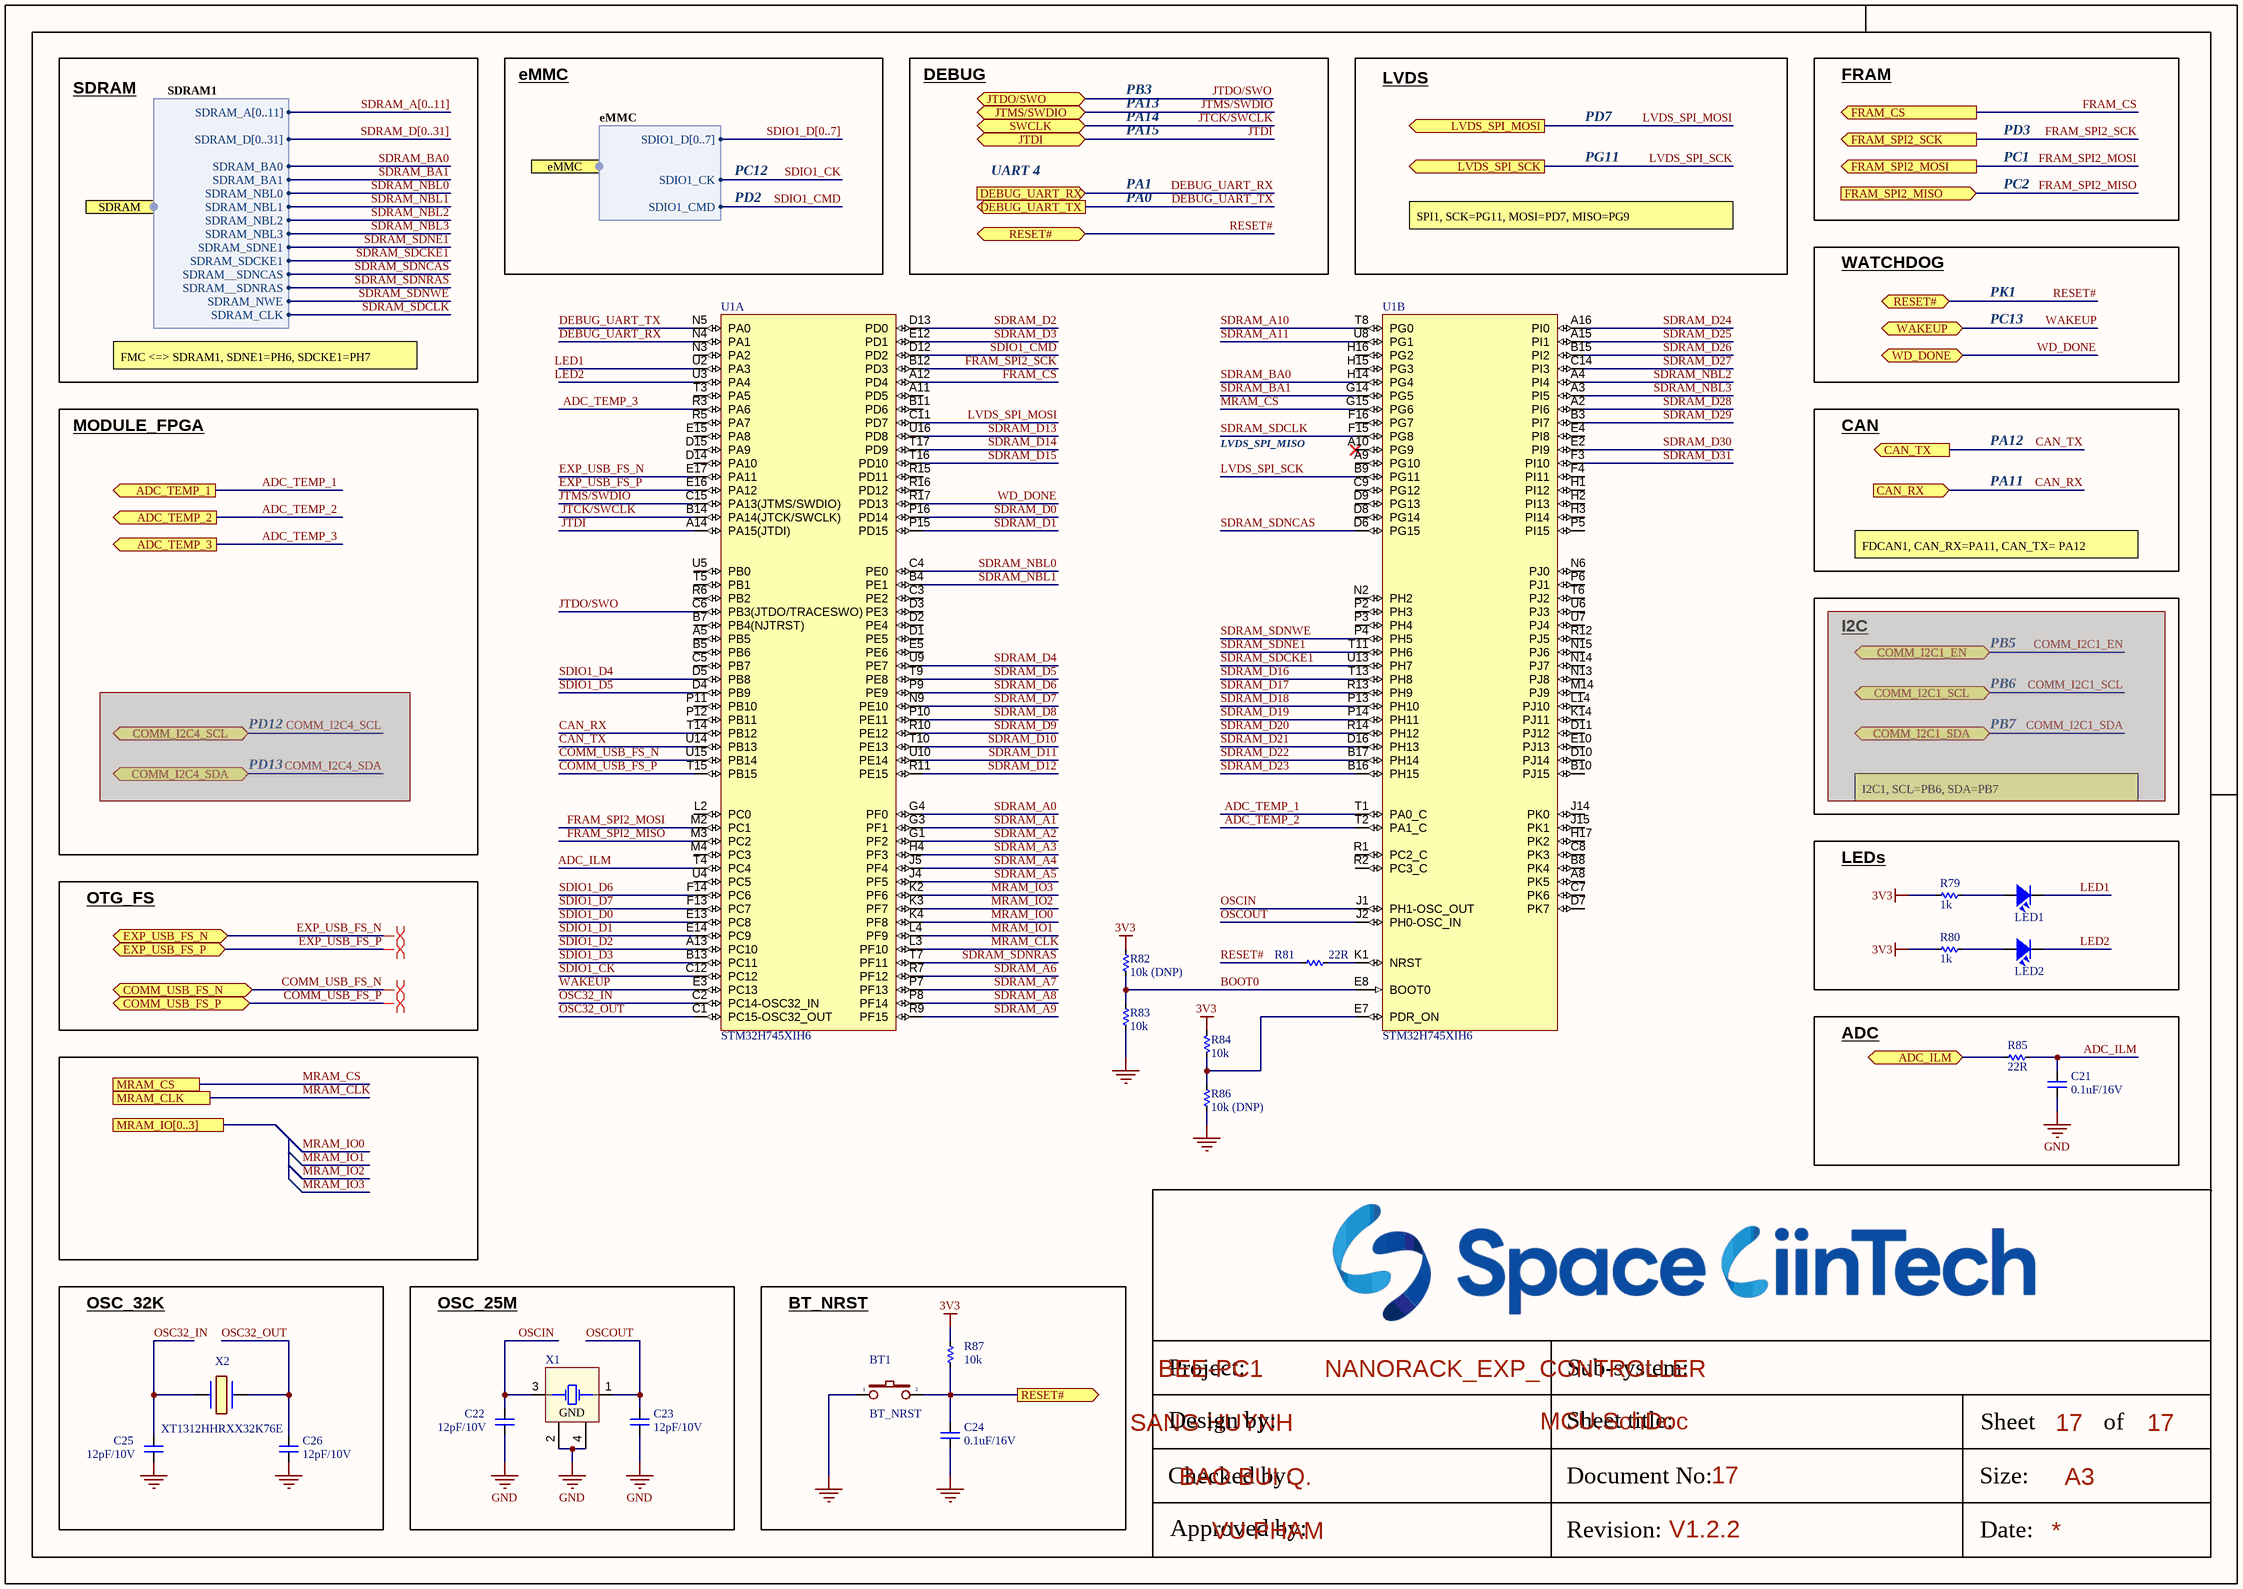
[diagram p16: MCU.SchDoc]

### Parts
BT1  BT_NRST  [SW2-SMD]
C21  0.1uF/16V  [CAP_C_1608X80]
C22  12pF/10V  [CAP_C_1608X80]
C23  12pF/10V  [CAP_C_1608X80]
C24  0.1uF/16V  [CAP_C_1608X80]
C25  12pF/10V  [CAP_C_1608X80]
C26  12pF/10V  [CAP_C_1608X80]
LED1  150060BS75000  [LED_0603]  (value not drawn)
LED2  150060GS75000  [LED_0603]  (value not drawn)
R79  1k  [RES_C_1608X60]
R80  1k  [RES_C_1608X60]
R81  22R  [RES_C_1608X60]
R82  10k (DNP)  [RES_C_1608X60]
R83  10k  [RES_C_1608X60]
R84  10k  [RES_C_1608X60]
R85  22R  [RES_C_1608X60]
R86  10k (DNP)  [RES_C_1608X60]
R87  10k  [RES_C_1608X60]
U1  STM32H745XIH6  [BGA265C80P17X17_1400X1400X110N]  (parts A,B of 3)
X1  ECS-250-12-33Q-JES-TR  [XTAL_ECS-250-12-33Q-JES-TR]  (value not drawn)
X2  XT1312HHRXX32K76E  [XT1312HHRXX32K76E]

### Blocks framed on the sheet
LEDs: LED1 LED2 R79 R80
ADC: C21 R85
OSC_32K: C25 C26 X2
OSC_25M: C22 C23 X1
BT_NRST: BT1 C24 R87

### Ports
ADC_ILM (bidir), ADC_TEMP_1 (out), ADC_TEMP_2 (out), ADC_TEMP_3 (out), CAN_RX (in), CAN_TX (out), COMM_I2C1_EN (bidir), COMM_I2C1_SCL (bidir), COMM_I2C1_SDA (bidir), COMM_I2C4_SCL (bidir), COMM_I2C4_SDA (bidir), COMM_USB_FS_N (bidir), COMM_USB_FS_P (bidir), DEBUG_UART_RX (in), DEBUG_UART_TX (out), eMMC (harness eMMC), EXP_USB_FS_N (bidir), EXP_USB_FS_P (bidir), FRAM_CS (out), FRAM_SPI2_MISO (in), FRAM_SPI2_MOSI (out), FRAM_SPI2_SCK (out), JTDI (bidir), JTDO/SWO (bidir), JTMS/SWDIO (bidir), LVDS_SPI_MOSI (out), LVDS_SPI_SCK (out), MRAM_CLK, MRAM_CS, MRAM_IO[0..3], RESET# (bidir), RESET# (out), SDRAM (harness SDRAM1), SWCLK (bidir), WAKEUP (bidir), WD_DONE (bidir)

### Harnesses
SDRAM1: SDRAM_A[0..11], SDRAM__SDNCAS, SDRAM_NBL0, SDRAM_SDNE1, SDRAM_SDCKE1, SDRAM_D[0..31], SDRAM_NBL1, SDRAM_BA0, SDRAM_BA1, SDRAM_NWE, SDRAM_CLK, SDRAM__SDNRAS, SDRAM_NBL3, SDRAM_NBL2
eMMC: SDIO1_D[0..7], SDIO1_CMD, SDIO1_CK

### Nets
3V3: R79.1 R80.1 R82.1 R84.1 R87.1
GND: BT1.1 C21.1 C22.1 C23.1 C24.1 C25.1 C26.1 R83.2 R86.2 X1.2(GND) X1.4(GND)
ADC_ILM: C21.2 R85.2 U1.T4(PC4)
ADC_TEMP_1: U1.T1(PA0_C) ; port ADC_TEMP_1
ADC_TEMP_2: U1.T2(PA1_C) ; port ADC_TEMP_2
ADC_TEMP_3: U1.R3(PA6) ; port ADC_TEMP_3
BOOT0: R82.2 R83.1 U1.E8(BOOT0)
CAN_RX: U1.T14(PB12) ; port CAN_RX
CAN_TX: U1.U14(PB13) ; port CAN_TX
COMM_USB_FS_N: U1.U15(PB14) ; port COMM_USB_FS_N
COMM_USB_FS_P: U1.T15(PB15) ; port COMM_USB_FS_P
DEBUG_UART_RX: U1.N4(PA1) ; port DEBUG_UART_RX
DEBUG_UART_TX: U1.N5(PA0) ; port DEBUG_UART_TX
EXP_USB_FS_N: U1.E17(PA11) ; port EXP_USB_FS_N
EXP_USB_FS_P: U1.E16(PA12) ; port EXP_USB_FS_P
FRAM_CS: U1.A12(PD4) ; port FRAM_CS
FRAM_SPI2_MISO: U1.M3(PC2) ; port FRAM_SPI2_MISO
FRAM_SPI2_MOSI: U1.M2(PC1) ; port FRAM_SPI2_MOSI
FRAM_SPI2_SCK: U1.B12(PD3) ; port FRAM_SPI2_SCK
JTCK/SWCLK: U1.B14(PA14(JTCK/SWCLK)) ; port SWCLK
JTDI: U1.A14(PA15(JTDI)) ; port JTDI
JTDO/SWO: U1.C6(PB3(JTDO/TRACESWO)) ; port JTDO/SWO
JTMS/SWDIO: U1.C15(PA13(JTMS/SWDIO)) ; port JTMS/SWDIO
LED1: LED1.2 U1.U2(PA3)
LED2: LED2.2 U1.U3(PA4)
LVDS_SPI_MOSI: U1.C11(PD7) ; port LVDS_SPI_MOSI
LVDS_SPI_SCK: U1.B9(PG11) ; port LVDS_SPI_SCK
MRAM_CLK: U1.L3(PF10) ; port MRAM_CLK
MRAM_CS: U1.G15(PG6) ; port MRAM_CS
MRAM_IO0: U1.K4(PF8)
MRAM_IO1: U1.L4(PF9)
MRAM_IO2: U1.K3(PF7)
MRAM_IO3: U1.K2(PF6)
OSC32_IN: C25.2 U1.C2(PC14-OSC32_IN) X2.1
OSC32_OUT: C26.2 U1.C1(PC15-OSC32_OUT) X2.2
OSCIN: C22.2 U1.J1(PH1-OSC_OUT) X1.3(XTAL)
OSCOUT: C23.2 U1.J2(PH0-OSC_IN) X1.1(XTAL)
RESET#: BT1.2 C24.2 R81.1 R87.2 ; port RESET#
SDIO1_CK: U1.C12(PC12) ; port eMMC.SDIO1_CK
SDIO1_CMD: U1.D12(PD2) ; port eMMC.SDIO1_CMD
SDIO1_D0: U1.E13(PC8)
SDIO1_D1: U1.E14(PC9)
SDIO1_D2: U1.A13(PC10)
SDIO1_D3: U1.B13(PC11)
SDIO1_D4: U1.D5(PB8)
SDIO1_D5: U1.D4(PB9)
SDIO1_D6: U1.F14(PC6)
SDIO1_D7: U1.F13(PC7)
SDRAM_A0: U1.G4(PF0)
SDRAM_A1: U1.G3(PF1)
SDRAM_A2: U1.G1(PF2)
SDRAM_A3: U1.H4(PF3)
SDRAM_A4: U1.J5(PF4)
SDRAM_A5: U1.J4(PF5)
SDRAM_A6: U1.R7(PF12)
SDRAM_A7: U1.P7(PF13)
SDRAM_A8: U1.P8(PF14)
SDRAM_A9: U1.R9(PF15)
SDRAM_A10: U1.T8(PG0)
SDRAM_A11: U1.U8(PG1)
SDRAM_BA0: U1.H14(PG4) ; port SDRAM.SDRAM_BA0
SDRAM_BA1: U1.G14(PG5) ; port SDRAM.SDRAM_BA1
SDRAM_D0: U1.P16(PD14)
SDRAM_D1: U1.P15(PD15)
SDRAM_D2: U1.D13(PD0)
SDRAM_D3: U1.E12(PD1)
SDRAM_D4: U1.U9(PE7)
SDRAM_D5: U1.T9(PE8)
SDRAM_D6: U1.P9(PE9)
SDRAM_D7: U1.N9(PE10)
SDRAM_D8: U1.P10(PE11)
SDRAM_D9: U1.R10(PE12)
SDRAM_D10: U1.T10(PE13)
SDRAM_D11: U1.U10(PE14)
SDRAM_D12: U1.R11(PE15)
SDRAM_D13: U1.U16(PD8)
SDRAM_D14: U1.T17(PD9)
SDRAM_D15: U1.T16(PD10)
SDRAM_D16: U1.T13(PH8)
SDRAM_D17: U1.R13(PH9)
SDRAM_D18: U1.P13(PH10)
SDRAM_D19: U1.P14(PH11)
SDRAM_D20: U1.R14(PH12)
SDRAM_D21: U1.D16(PH13)
SDRAM_D22: U1.B17(PH14)
SDRAM_D23: U1.B16(PH15)
SDRAM_D24: U1.A16(PI0)
SDRAM_D25: U1.A15(PI1)
SDRAM_D26: U1.B15(PI2)
SDRAM_D27: U1.C14(PI3)
SDRAM_D28: U1.A2(PI6)
SDRAM_D29: U1.B3(PI7)
SDRAM_D30: U1.E2(PI9)
SDRAM_D31: U1.F3(PI10)
SDRAM_NBL0: U1.C4(PE0) ; port SDRAM.SDRAM_NBL0
SDRAM_NBL1: U1.B4(PE1) ; port SDRAM.SDRAM_NBL1
SDRAM_NBL2: U1.A4(PI4) ; port SDRAM.SDRAM_NBL2
SDRAM_NBL3: U1.A3(PI5) ; port SDRAM.SDRAM_NBL3
SDRAM_SDCKE1: U1.U13(PH7) ; port SDRAM.SDRAM_SDCKE1
SDRAM_SDCLK: U1.F15(PG8) ; port SDRAM.SDRAM_CLK
SDRAM_SDNCAS: U1.D6(PG15) ; port SDRAM.SDRAM__SDNCAS
SDRAM_SDNE1: U1.T11(PH6) ; port SDRAM.SDRAM_SDNE1
SDRAM_SDNRAS: U1.T7(PF11) ; port SDRAM.SDRAM__SDNRAS
SDRAM_SDNWE: U1.P4(PH5) ; port SDRAM.SDRAM_NWE
WAKEUP: U1.E3(PC13) ; port WAKEUP
WD_DONE: U1.R17(PD13) ; port WD_DONE
NetLED1_1: LED1.1 R79.2
NetLED2_1: LED2.1 R80.2
NetR81_2: R81.2 U1.K1(NRST)
NetR84_2: R84.2 R86.1 U1.E7(PDR_ON)
NetR85_1: R85.1 ; port ADC_ILM

Not connected (* = marked no-connect by the designer): U1 A5(PB5) A8(PK5) A9(PG10) A10(PG9)* A11(PD5) B5(PB6) B7(PB4(NJTRST)) B8(PK4) B10(PJ15) B11(PD6) C3(PE2) C5(PB7) C7(PK6) C8(PK3) C9(PG12) D1(PE5) D2(PE4) D3(PE3) D7(PK7) D8(PG14) D9(PG13) D10(PJ14) D11(PJ12) D14(PA10) D15(PA9) E4(PI8) E5(PE6) E10(PJ13) E15(PA8) F4(PI11) F16(PG7) H1(PI12) H2(PI13) H3(PI14) H15(PG3) H16(PG2) H17(PK2) J14(PK0) J15(PK1) K14(PJ11) L2(PC0) L14(PJ10) M4(PC3) M14(PJ9) N2(PH2) N3(PA2) N6(PJ0) N13(PJ8) N14(PJ7) N15(PJ6) P2(PH3) P3(PH4) P5(PI15) P6(PJ1) P11(PB10) P12(PB11) R1(PC2_C) R2(PC3_C) R5(PA7) R6(PB2) R12(PJ5) R15(PD11) R16(PD12) T3(PA5) T5(PB1) T6(PJ2) U4(PC5) U5(PB0) U6(PJ3) U7(PJ4)

### Buses and harness runs
bus SDIO1_D[0..7]
bus SDRAM_A[0..11]
bus SDRAM_D[0..31]

### Layout directives
differential pair: COMM_USB_FS_N, COMM_USB_FS_P, EXP_USB_FS_N, EXP_USB_FS_P

### Notes on the sheet
- SDRAM
- eMMC
- DEBUG
- PB3
- PA13
- PA14
- LVDS
- PD7
- FRAM
- PC12
- UART 4
- PA15
- PA1
- PG11
- PC1
- PC2
- PD3
- PD2
- PA0
- SPI1, SCK=PG11, MOSI=PD7, MISO=PG9
- WATCHDOG
- PK1
- PC13
- FMC <=> SDRAM1, SDNE1=PH6, SDCKE1=PH7
- MODULE_FPGA
- LVDS_SPI_MISO
- CAN
- PA12
- PA11
- FDCAN1, CAN_RX=PA11, CAN_TX= PA12
- I2C
- PB5
- PD12
- PB6
- PB7
- PD13
- I2C1, SCL=PB6, SDA=PB7
- OTG_FS
- Project:
- BEE-PC1
- Sub-system:
- NANORACK_EXP_CONTROLLER
- Design by:
- SANG HUYNH
- BAO BUI Q.
- Sheet title:
- Sheet
- A3
- of
- Checked by:
- Approved by:
- VU PHAM
- Revision:
- Document No:
- V1.2.2
- Size:
- Date:

### Library data of the parts
BT1 = BT2: Switch button 2 pin; Value: SW chip 2 pin
C21-C26 = CAP_SMD: CAP_Chip; Value: 33pF
LED1 LED2 = LED SMD: Value: LED 3 - 5 ly 2 Colour
R79-R87 = _RES_B_2: RES
U1 = STM32H745XIH6: as U1 on sheet MCU_POWER; Copyright: Copyright (C) 2025 Ultra Librarian. All rights reserved.; Manufacturer_Part_Number: STM32H745XIH6; Datasheet: https://www.st.com/resource/en/datasheet/stm32h745zg.pdf; RefDes: RefDes; Type: Type
X1 = XT4: Crystal, 25 MHz, -30 to 85 degC, 3.2 x 2.5 x 0.9 mm SMD; Value: 4Mhz
X2 = XT1312HHRXX32K76E: 32.768 kHz +/-20ppm Crystal 12pF 70 kOhms 2-SMD, No Lead , -40C ~ 85C; Manufacturer_Name: Vishay; Geometry.Height: 0.8mm; Mouser Part Number: 70-XT1312HHRXX32K76E; Mouser Price/Stock: https://www.mouser.co.uk/ProductDetail/Vishay-Dale/XT1312HHRXX32K76E?qs=jcD%2FCkGBYeMqyUz9UpSqCw%3D%3D; Arrow Part Number: *; Arrow Price/Stock: *; Datasheet Link: https://www.vishay.com/docs/35071/xt13.pdf; Manufacturer_Part_Number: XT1312HHRXX32K76E